# EAGLE design On Axis Encoder (EAGLE 9.6.1)

## Sheet 1 of 8: ATSAMD21G18
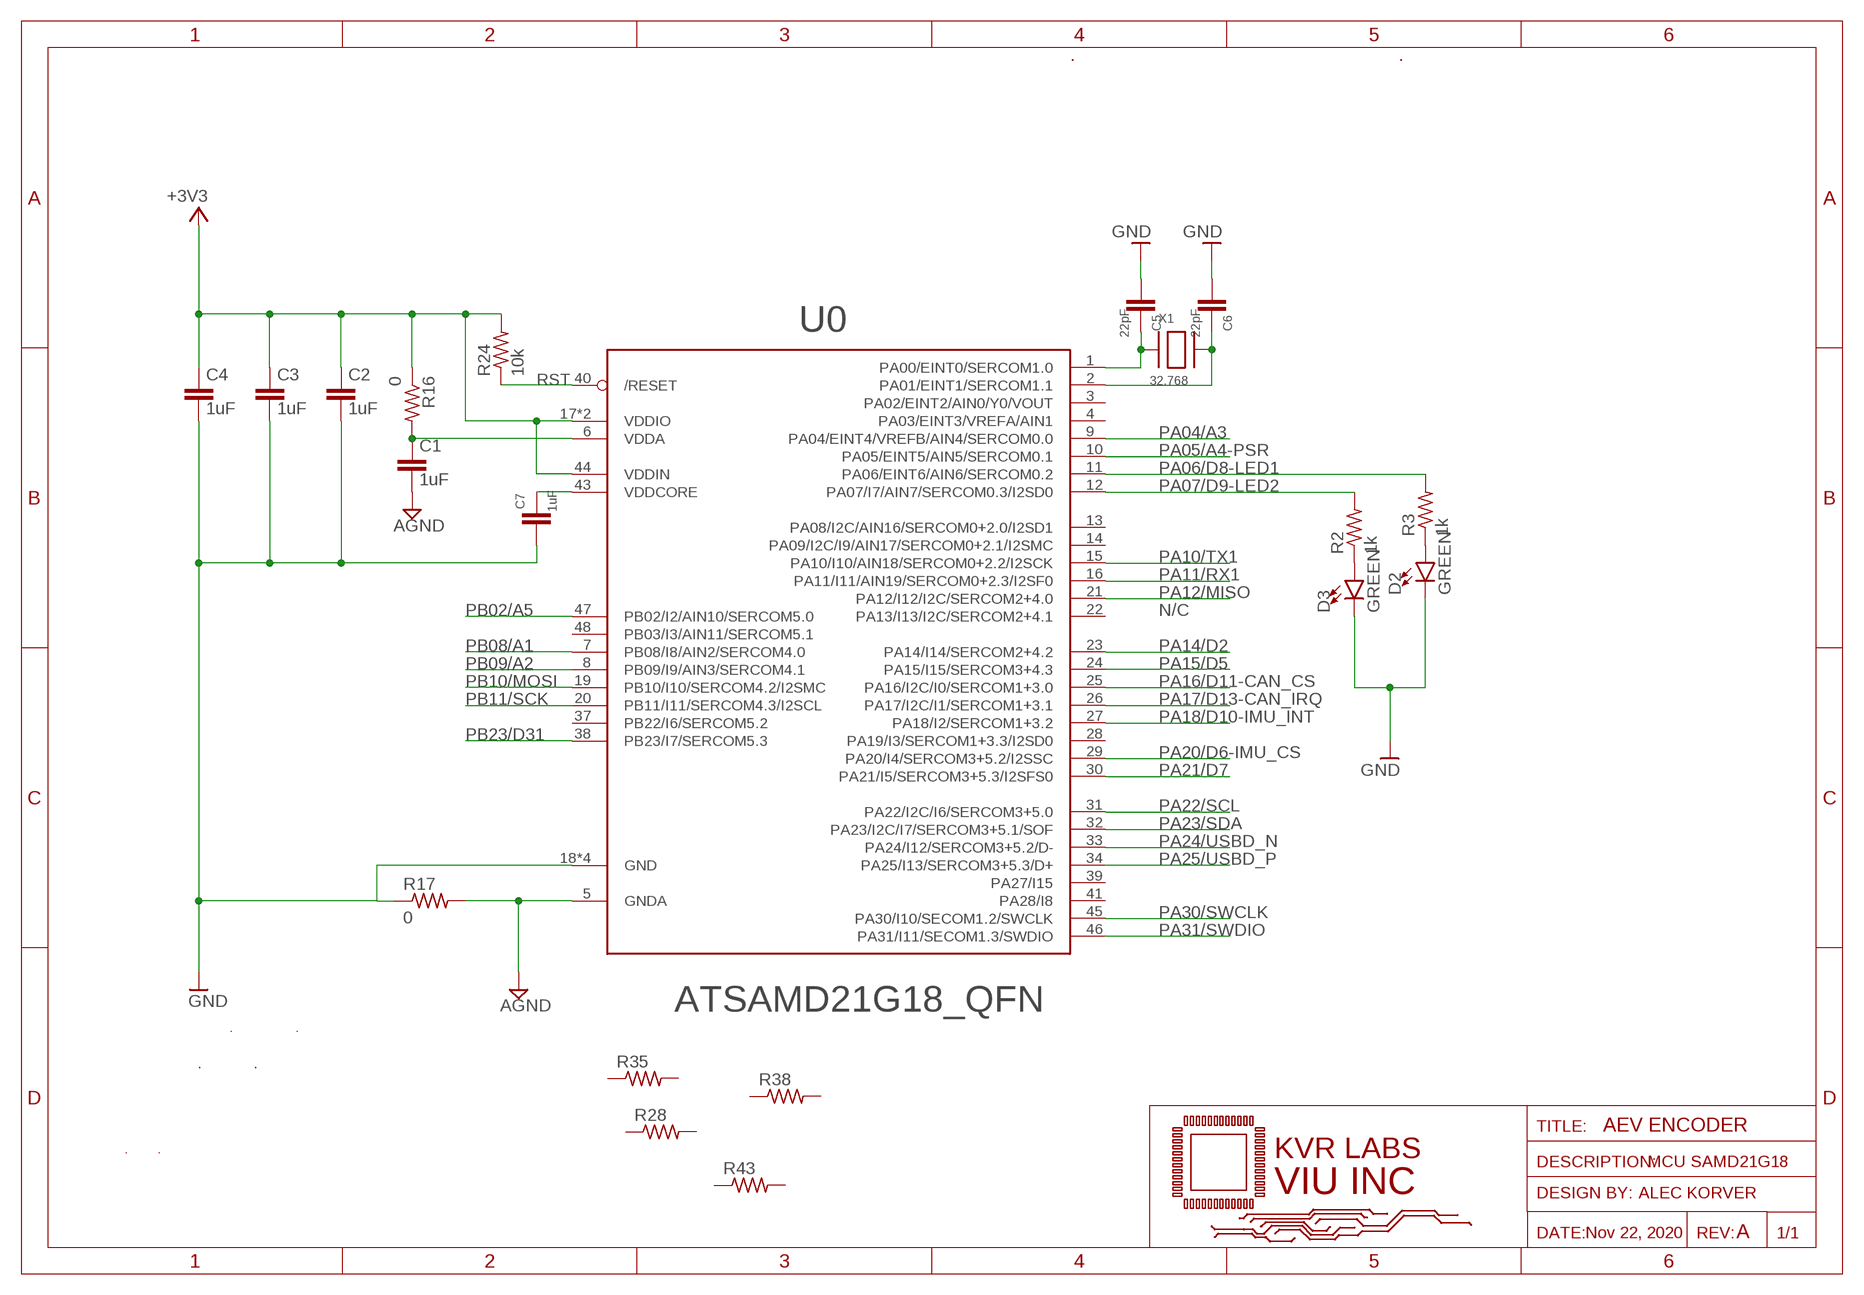
[diagram p0: schematic, sheet 1]

### Parts
C1  1uF  C-EUC0805  [C0805]
C2  1uF  C-EUC0805  [C0805]
C3  1uF  C-EUC0805  [C0805]
C4  1uF  C-EUC0805  [C0805]
C5  22pF  C-EUC0805  [C0805]
C6  22pF  C-EUC0805  [C0805]
C7  1uF  C-EUC0805  [C0805]
D2  GREEN  LED-RED0603  [LED-0603]
D3  GREEN  LED-RED0603  [LED-0603]
R2  1k  R-US_R0603  [R0603]
R3  1k  R-US_R0603  [R0603]
R16  0  R-US_R0805  [R0805]
R17  0  R-US_R0805  [R0805]
R24  10k  R-US_R0805  [R0805]
R28  R-US_R0603  [R0603]
R35  R-US_R0402  [R0402]
R38  R-US_R0201  [R0201]
R43  R-US_R0805  [R0805]
U0  ATSAMD21G18_QFN  ATSAMD21J_QFN  [MICROBUILDER_TQFN48_7MM]
X1  32.768  XTAL-3.2X1.5  [XTAL3215]

### Nets
+3V3: C2.1 C3.1 C4.1 R16.1 R24.2 U0.17(VDDIO) U0.36(VDDIO) U0.44(VDDIN) ; also sheet 3,4,5,6,7,8
AGND: C1.2 R17.2 U0.5(GNDA) ; also sheet 4,8
GND: C2.2 C3.2 C4.2 C5.2 C6.2 C7.2 D2.C D3.C R17.1 U0.18(GND) U0.35(GND) U0.42(GND) U0.THERMAL(GND) ; also sheet 3,4,5,6,7
N$3: D2.A R3.1
N$4: D3.A R2.1
N$9: C5.1 U0.1(PA00/EINT0/SERCOM1.0) X1.P$1
N$10: C6.1 U0.2(PA01/EINT1/SERCOM1.1) X1.P$2
N$23: C1.1 R16.2 U0.6(VDDA)
PA04/A3: U0.9(PA04/EINT4/VREFB/AIN4/SERCOM0.0)
PA05/A4-PSR: U0.10(PA05/EINT5/AIN5/SERCOM0.1) ; also sheet 4
PA06/D8-LED1: R3.2 U0.11(PA06/EINT6/AIN6/SERCOM0.2)
PA07/D9-LED2: R2.2 U0.12(PA07/I7/AIN7/SERCOM0.3/I2SD0)
PA10/TX1: U0.15(PA10/I10/AIN18/SERCOM0+2.2/I2SCK)
PA11/RX1: U0.16(PA11/I11/AIN19/SERCOM0+2.3/I2SF0)
PA12/MISO: U0.21(PA12/I12/I2C/SERCOM2+4.0) ; also sheet 5,7
PA14/D2: U0.23(PA14/I14/SERCOM2+4.2)
PA15/D5: U0.24(PA15/I15/SERCOM3+4.3)
PA16/D11-CAN_CS: U0.25(PA16/I2C/I0/SERCOM1+3.0) ; also sheet 5
PA17/D13-CAN_IRQ: U0.26(PA17/I2C/I1/SERCOM1+3.1) ; also sheet 5
PA18/D10-IMU_INT: U0.27(PA18/I2/SERCOM1+3.2) ; also sheet 7
PA20/D6-IMU_CS: U0.29(PA20/I4/SERCOM3+5.2/I2SSC) ; also sheet 7
PA21/D7: U0.30(PA21/I5/SERCOM3+5.3/I2SFS0)
PA22/SCL: U0.31(PA22/I2C/I6/SERCOM3+5.0) ; also sheet 6
PA23/SDA: U0.32(PA23/I2C/I7/SERCOM3+5.1/SOF) ; also sheet 6
PA24/USBD_N [diff pair]: U0.33(PA24/I12/SERCOM3+5.2/D-) ; also sheet 4
PA25/USBD_P [diff pair]: U0.34(PA25/I13/SERCOM3+5.3/D+) ; also sheet 4
PA30/SWCLK: U0.45(PA30/I10/SECOM1.2/SWCLK) ; also sheet 4
PA31/SWDIO: U0.46(PA31/I11/SECOM1.3/SWDIO) ; also sheet 4
PB02/A5: U0.47(PB02/I2/AIN10/SERCOM5.0)
PB08/A1: U0.7(PB08/I8/AIN2/SERCOM4.0)
PB09/A2: U0.8(PB09/I9/AIN3/SERCOM4.1)
PB10/MOSI: U0.19(PB10/I10/SERCOM4.2/I2SMC) ; also sheet 5,7
PB11/SCK: U0.20(PB11/I11/SERCOM4.3/I2SCL) ; also sheet 5,7
PB23/D31: U0.38(PB23/I7/SERCOM5.3)
RST: R24.1 U0.40(/RESET) ; also sheet 4
VDDCORE2: C7.1 U0.43(VDDCORE)
Unconnected: R28.1 R28.2 R35.1 R35.2 R38.1 R38.2 R43.1 R43.2 U0.3(PA02/EINT2/AIN0/Y0/VOUT) U0.4(PA03/EINT3/VREFA/AIN1) U0.13(PA08/I2C/AIN16/SERCOM0+2.0/I2SD1) U0.14(PA09/I2C/I9/AIN17/SERCOM0+2.1/I2SMC) U0.22(PA13/I13/I2C/SERCOM2+4.1) U0.28(PA19/I3/SERCOM1+3.3/I2SD0) U0.37(PB22/I6/SERCOM5.2) U0.39(PA27/I15) U0.41(PA28/I8) U0.48(PB03/I3/AIN11/SERCOM5.1)

### Notes on the sheet
- N/C
- AEV ENCODER
- MCU SAMD21G18
- Nov 22, 2020 | A

## Sheet 2 of 8: ABSOLUTE ENCODER
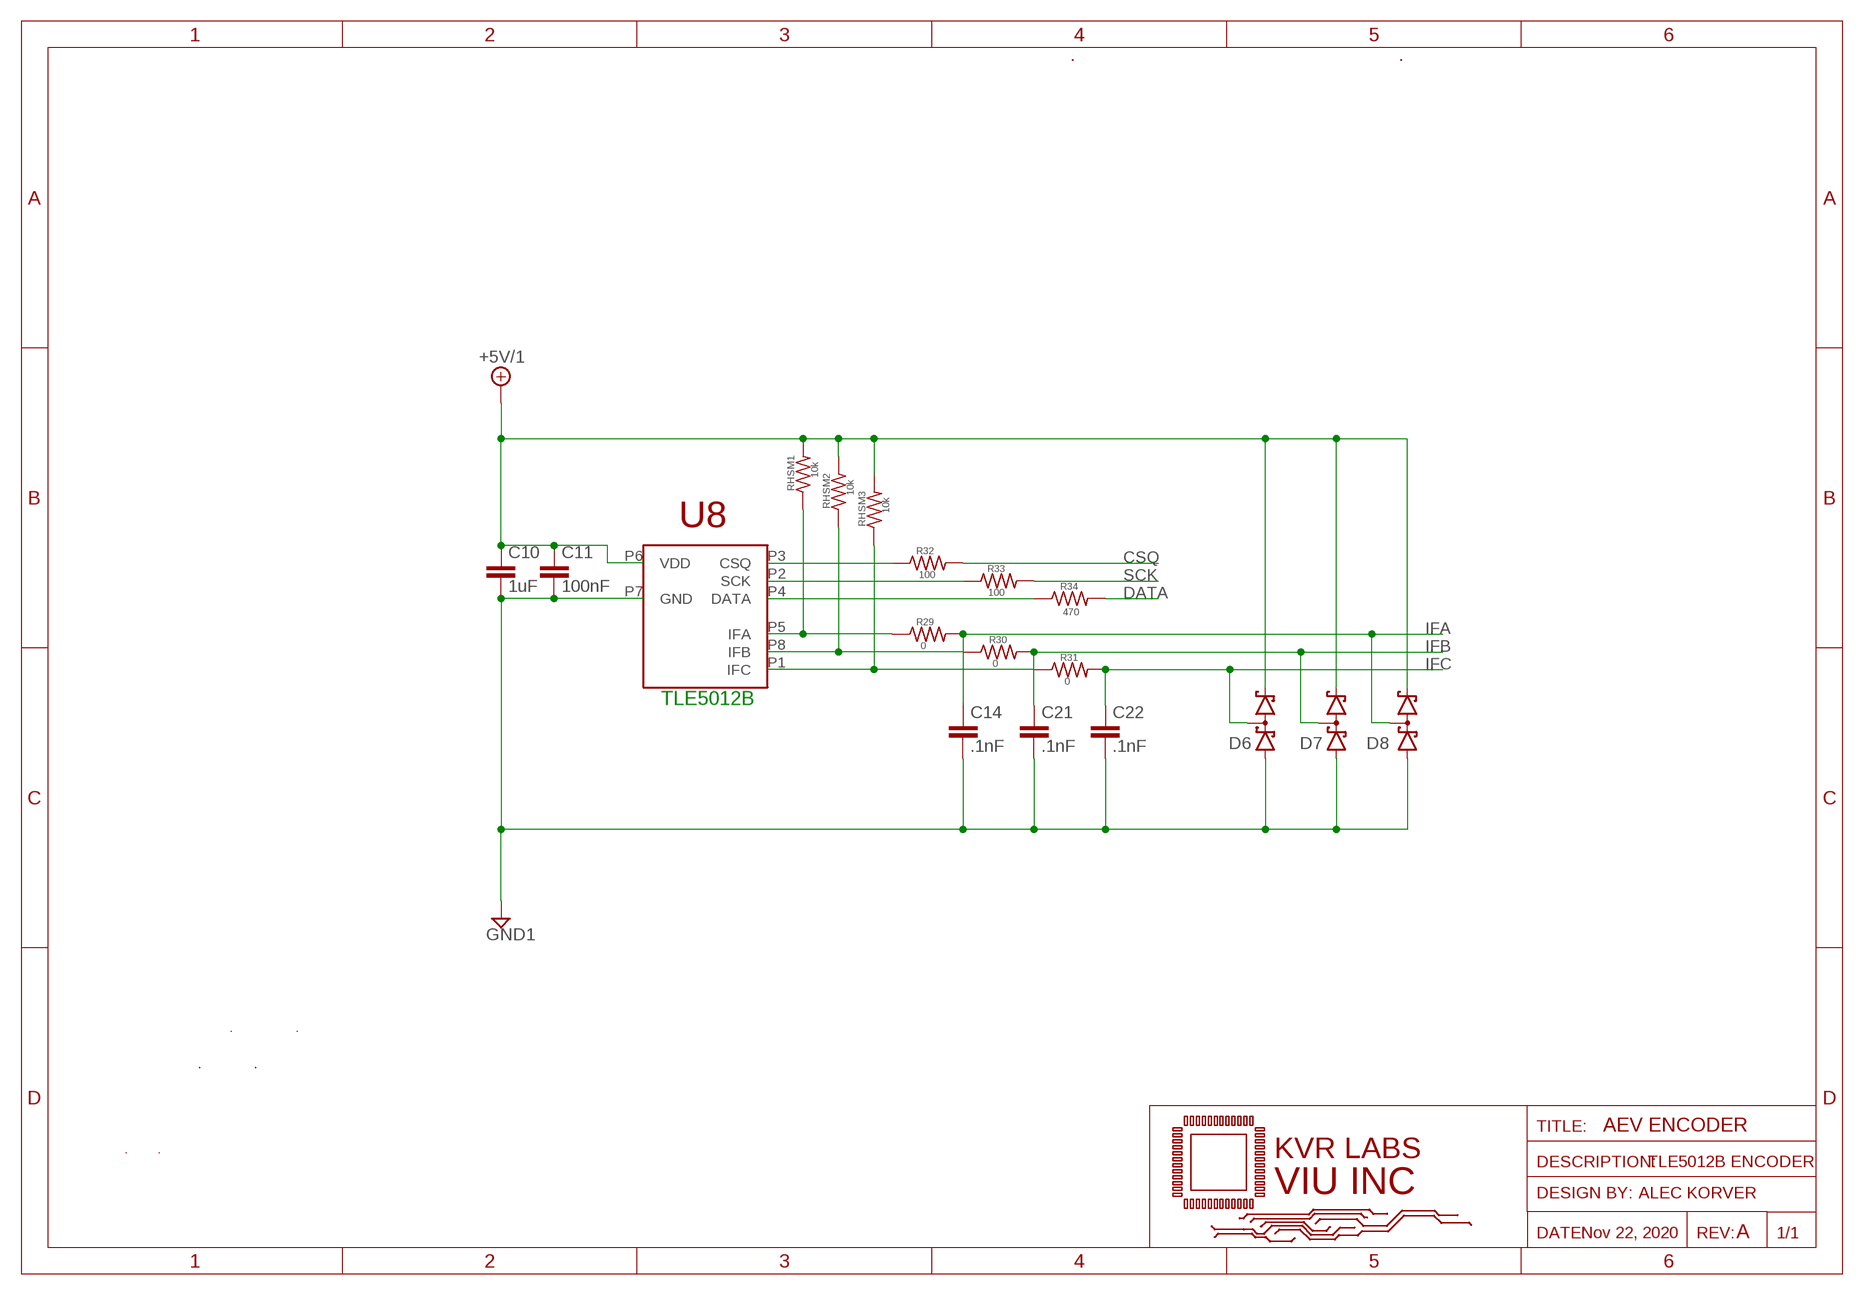
[diagram p1: schematic, sheet 2]

### Parts
C10  1uF  C-EUC0805  [C0805]
C11  100nF  C-EUC0805  [C0805]
C14  .1nF  C-EUC0805  [C0805]
C21  .1nF  C-EUC0805  [C0805]
C22  .1nF  C-EUC0805  [C0805]
D6  BAS70-04  [SOT23]
D7  BAS70-04  [SOT23]
D8  BAS70-04  [SOT23]
R29  0  R-US_R0805  [R0805]
R30  0  R-US_R0805  [R0805]
R31  0  R-US_R0805  [R0805]
R32  100  R-US_R0805  [R0805]
R33  100  R-US_R0805  [R0805]
R34  470  R-US_R0805  [R0805]
RHSM1  10k  R-US_R0805  [R0805]
RHSM2  10k  R-US_R0805  [R0805]
RHSM3  10k  R-US_R0805  [R0805]
U8  TLE5012B  [PG-DSO-8]

### Nets
+5V/1: C10.1 C11.1 D6.2(C2) D7.2(C2) D8.2(C2) RHSM1.2 RHSM2.2 RHSM3.2 U8.P6(VDD) ; also sheet 4
CSQ: R32.2 ; also sheet 4
DATA: R34.2 ; also sheet 4
GND1: C10.2 C11.2 C14.2 C21.2 C22.2 D6.1(A1) D7.1(A1) D8.1(A1) U8.P7(GND) ; also sheet 4
IFA: C14.1 D8.3(C1A2) R29.2 ; also sheet 4
IFB: C21.1 D7.3(C1A2) R30.2 ; also sheet 4
IFC: C22.1 D6.3(C1A2) R31.2 ; also sheet 4
N$35: R32.1 U8.P3(CSQ)
N$36: R33.1 U8.P2(SCK)
N$37: R34.1 U8.P4(DATA)
N$38: R29.1 RHSM1.1 U8.P5(IFA)
N$39: R30.1 RHSM2.1 U8.P8(IFB)
N$40: R31.1 RHSM3.1 U8.P1(IFC)
SCK: R33.2 ; also sheet 4

### Notes on the sheet
- U8
- TLE5012B
- AEV ENCODER
- TLE5012B ENCODER
- Nov 22, 2020 | A

## Sheet 3 of 8: Low Dropout Regulator 3v3
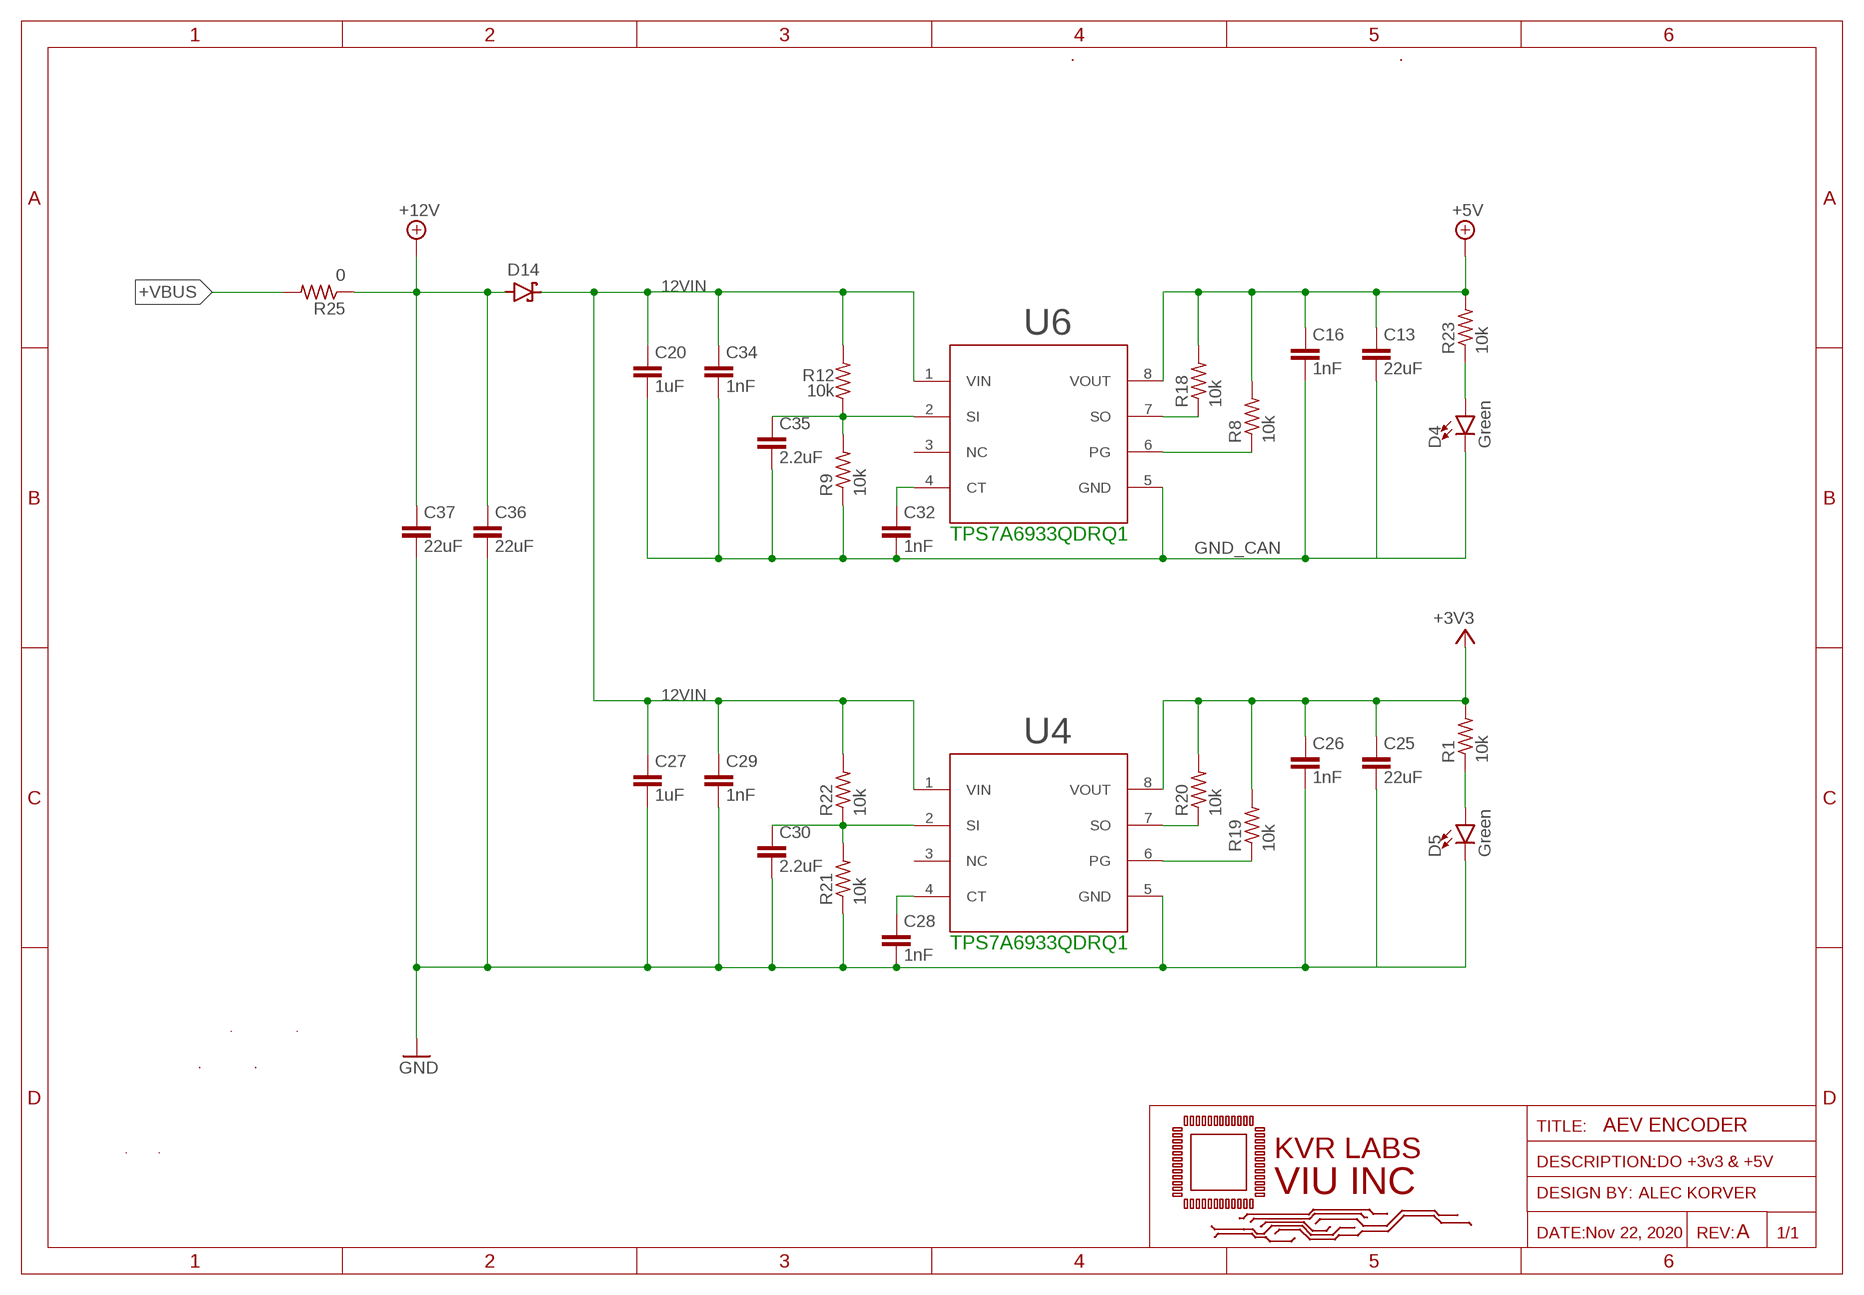
[diagram p2: schematic, sheet 3]

### Parts
C13  22uF  C-EUC0805  [C0805]
C16  1nF  C-EUC0805  [C0805]
C20  1uF  C-EUC0805  [C0805]
C25  22uF  C-EUC0805  [C0805]
C26  1nF  C-EUC0805  [C0805]
C27  1uF  C-EUC0805  [C0805]
C28  1nF  C-EUC0805  [C0805]
C29  1nF  C-EUC0805  [C0805]
C30  2.2uF  C-EUC0805  [C0805]
C32  1nF  C-EUC0805  [C0805]
C34  1nF  C-EUC0805  [C0805]
C35  2.2uF  C-EUC0805  [C0805]
C36  22uF  C-EUC1206  [C1206]
C37  22uF  C-EUC1206  [C1206]
D4  Green  LED-GREEN1206-BOTTOM  [LED-1206-BOTTOM]
D5  Green  LED-GREEN1206-BOTTOM  [LED-1206-BOTTOM]
D14  MBR0520LT1G  SCHOTTKY_MBR0520LT1GDO-219  [SODFL3718X115]
R1  10k  R-US_R0805  [R0805]
R8  10k  R-US_R0805  [R0805]
R9  10k  R-US_R0805  [R0805]
R12  10k  R-US_R0805  [R0805]
R18  10k  R-US_R0805  [R0805]
R19  10k  R-US_R0805  [R0805]
R20  10k  R-US_R0805  [R0805]
R21  10k  R-US_R0805  [R0805]
R22  10k  R-US_R0805  [R0805]
R23  10k  R-US_R0805  [R0805]
R25  0  R-US_R0805  [R0805]
U4  Value  TPS7A6933QDRQ1  [D0008A_N]
U6  Value  TPS7A6933QDRQ1  [D0008A_N]

### Nets
12VIN: C20.1 C27.1 C29.1 C34.1 D14.1(C) R12.2 R22.2 U4.1(VIN) U6.1(VIN)
+3V3: C25.1 C26.1 R1.2 R19.2 R20.2 U4.8(VOUT) ; also sheet 1,4,5,6,7,8
+5V: C13.1 C16.1 R8.2 R18.2 R23.2 U6.8(VOUT) ; also sheet 5
+12V: C36.1 C37.1 D14.2(A) R25.1 ; also sheet 4
+VBUS: R25.2 ; also sheet 4
GND: C25.2 C26.2 C27.2 C28.2 C29.2 C30.2 C36.2 C37.2 D5.C R21.1 U4.5(GND) ; also sheet 1,4,5,6,7
GND_CAN: C13.2 C16.2 C20.2 C32.2 C34.2 C35.2 D4.C R9.1 U6.5(GND) ; also sheet 5
N$2: D5.A R1.1
N$5: C35.1 R9.2 R12.1 U6.2(SI)
N$12: C30.1 R21.2 R22.1 U4.2(SI)
N$16: R19.1 U4.6(PG)
N$17: R20.1 U4.7(SO)
N$18: C28.1 U4.4(CT)
N$19: R8.1 U6.6(PG)
N$20: R18.1 U6.7(SO)
N$21: C32.1 U6.4(CT)
N$22: D4.A R23.1
Unconnected: U4.3(NC) U6.3(NC)

### Notes on the sheet
- TPS7A6933QDRQ1
- TPS7A6933QDRQ1
- AEV ENCODER
- LDO +3v3 & +5V
- Nov 22, 2020 | A

## Sheet 4 of 8: Connectors
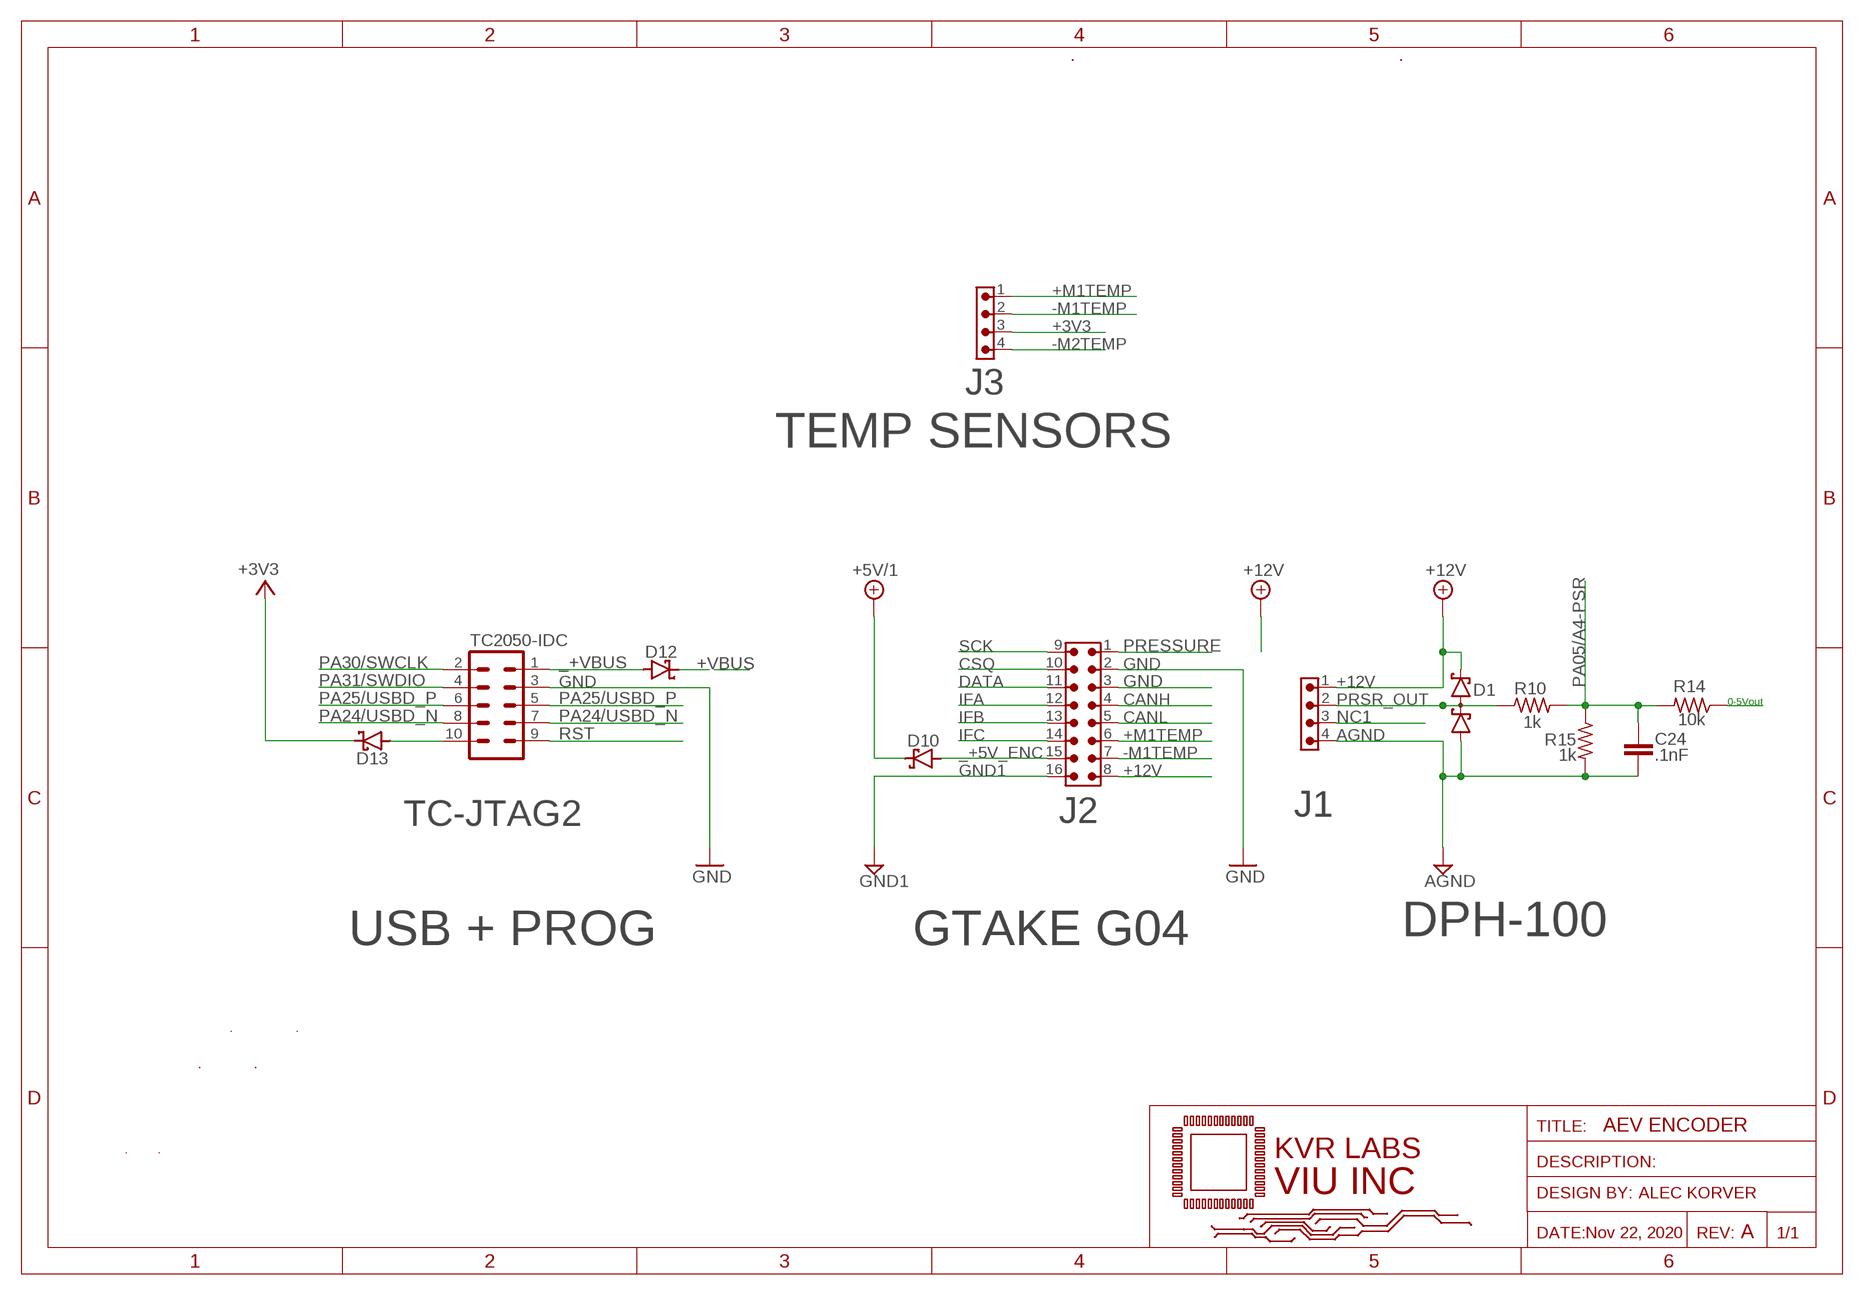
[diagram p3: schematic, sheet 4]

### Parts
C24  .1nF  C-EUC0805  [C0805]
D1  BAS70-04  [SOT23]
D10  MBR0520LT1G  SCHOTTKY_MBR0520LT1GDO-219  [SODFL3718X115]
D12  MBR0520LT1G  SCHOTTKY_MBR0520LT1GDO-219  [SODFL3718X115]
D13  MBR0520LT1G  SCHOTTKY_MBR0520LT1GDO-219  [SODFL3718X115]
J1  6620XX11122_66200411122  [66200411122]
J2  6620XX21122_66201621122  [66201621122]
J3  6620XX11122_66200411122  [66200411122]
R10  1k  R-US_R0805  [R0805]
R14  10k  R-US_R0805  [R0805]
R15  1k  R-US_R0805  [R0805]
TC-JTAG2  TC2050-IDC  [TC2050-IDC]

### Nets
+3V3: D13.1(C) J3.3 ; also sheet 1,3,5,6,7,8
+5V/1: D10.1(C) ; also sheet 2
+12V: D1.2(C2) J1.1 J2.8 ; also sheet 3
+M1TEMP: J2.6 J3.1
+VBUS: D12.1(C) ; also sheet 3
-M1TEMP: J2.7 J3.2
-M2TEMP: J3.4 ; also sheet 8
_+5V_ENC: D10.2(A) J2.15
_+VBUS: D12.2(A) TC-JTAG2.1
AGND: C24.2 D1.1(A1) J1.4 R15.2 ; also sheet 1,8
CANH: J2.4 ; also sheet 5
CANL: J2.5 ; also sheet 5
CSQ: J2.10 ; also sheet 2
DATA: J2.11 ; also sheet 2
GND: J2.2 J2.3 TC-JTAG2.3 ; also sheet 1,3,5,6,7
GND1: J2.16 ; also sheet 2
IFA: J2.12 ; also sheet 2
IFB: J2.13 ; also sheet 2
IFC: J2.14 ; also sheet 2
N$13: D13.2(A) TC-JTAG2.10
NC1: J1.3
PA05/A4-PSR: C24.1 R10.2 R14.2 R15.1 ; also sheet 1
PA24/USBD_N [diff pair]: TC-JTAG2.7 TC-JTAG2.8 ; also sheet 1
PA25/USBD_P [diff pair]: TC-JTAG2.5 TC-JTAG2.6 ; also sheet 1
PA30/SWCLK: TC-JTAG2.2 ; also sheet 1
PA31/SWDIO: TC-JTAG2.4 ; also sheet 1
PRESSURE: J2.1 R14.1
PRSR_OUT: D1.3(C1A2) J1.2 R10.1
RST: TC-JTAG2.9 ; also sheet 1
SCK: J2.9 ; also sheet 2

### Notes on the sheet
- TEMP SENSORS
- 0-5Vout
- USB + PROG | GTAKE G04 | DPH-100
- AEV ENCODER
- Nov 22, 2020 | A

## Sheet 5 of 8: CANbus
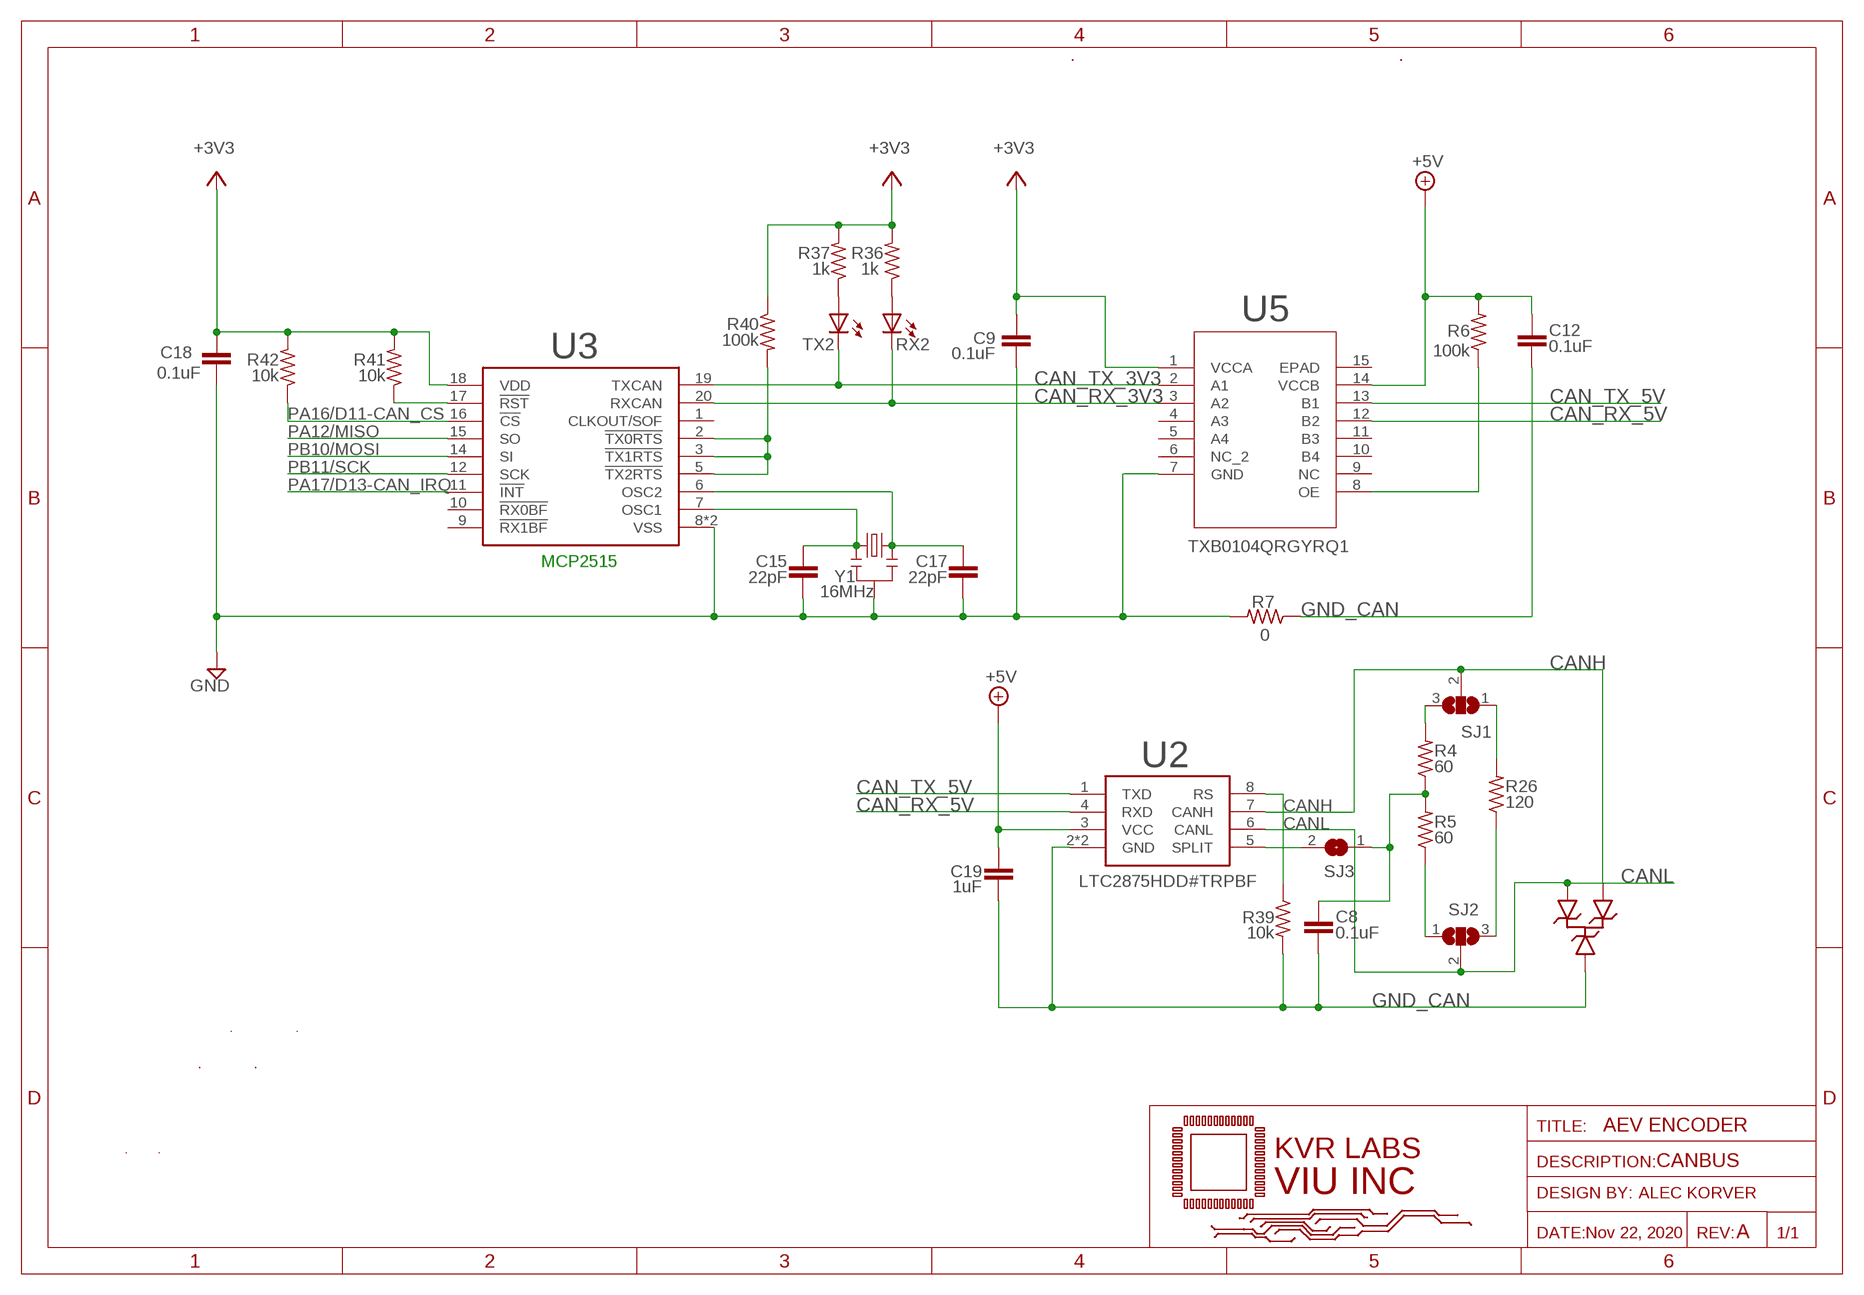
[diagram p4: schematic, sheet 5]

### Parts
C8  0.1uF  C-EUC0805  [C0805]
C9  0.1uF  C-EUC0805  [C0805]
C12  0.1uF  C-EUC0805  [C0805]
C15  22pF  C-EUC0805  [C0805]
C17  22pF  C-EUC0805  [C0805]
C18  0.1uF  C-EUC0805  [C0805]
C19  1uF  C-EUC0805  [C0805]
R4  60  R-US_R0805  [R0805]
R5  60  R-US_R0805  [R0805]
R6  100k  R-US_R0805  [R0805]
R7  0  R-US_R0805  [R0805]
R26  120  R-US_R0805  [R0805]
R36  1k  R-US_R0805  [R0805]
R37  1k  R-US_R0805  [R0805]
R39  10k  R-US_R0805  [R0805]
R40  100k  R-US_R0805  [R0805]
R41  10k  R-US_R0805  [R0805]
R42  10k  R-US_R0805  [R0805]
RX2  LEDCHIPLED_0805  [CHIPLED_0805]
SJ1  SJ2W  [SJ_2]
SJ2  SJ2W  [SJ_2]
SJ3  SJ  [SJ]
TX2  LEDCHIPLED_0805  [CHIPLED_0805]
U2  LTC2875HDD#TRPBF  LTC2875-8-DFN  [SON50P300X300X80-9T165X238N]
U3  MCP2515-E/ML  MCP2515QFN-20  [QFN50P400X400X100-21T270N]
U5  TXB0104QRGYRQ1  [RGY14_2P05X2P05]
U$2  μCLAMP2492SQ  [SOT-23_3L_ONS]
Y1  16MHz  RESONATORSMD  [RESONATOR-SMD]

### Nets
+3V3: C9.1 C18.1 R36.2 R37.2 R40.1 R41.2 R42.2 U3.18(VDD) U5.1(VCCA) ; also sheet 1,3,4,6,7,8
+5V: C12.1 C19.1 R6.2 U2.3(VCC) U5.14(VCCB) ; also sheet 3
CAN_RX_3V3: RX2.C U3.20(RXCAN) U5.3(A2)
CAN_RX_5V: U2.4(RXD) U5.12(B2)
CAN_TX_3V3: TX2.C U3.19(TXCAN) U5.2(A1)
CAN_TX_5V: U2.1(TXD) U5.13(B1)
CANH: SJ1.2 U2.7(CANH) U$2.2 ; also sheet 4
CANL: SJ2.2 U2.6(CANL) U$2.1 ; also sheet 4
GND: C9.2 C15.2 C17.2 C18.2 R7.2 U3.8(VSS) U3.21(VSS) U5.7(GND) Y1.2 ; also sheet 1,3,4,6,7
GND_CAN: C8.2 C12.2 C19.2 R7.1 R39.2 U2.2(GND) U2.9(GND) U$2.3 ; also sheet 3
N$6: R6.1 U5.8(OE)
N$7: R39.1 U2.8(RS)
N$8: SJ3.2 U2.5(SPLIT)
N$26: R36.1 RX2.A
N$27: R37.1 TX2.A
N$30: R41.1 U3.17(!RST)
N$31: R40.2 U3.2(!TX0RTS) U3.3(!TX1RTS) U3.5(!TX2RTS)
N$32: C17.1 U3.6(OSC2) Y1.3
N$33: C15.1 U3.7(OSC1) Y1.1
PA12/MISO: U3.15(SO) ; also sheet 1,7
PA16/D11-CAN_CS: R42.1 U3.16(!CS) ; also sheet 1
PA17/D13-CAN_IRQ: U3.11(!INT) ; also sheet 1
PB10/MOSI: U3.14(SI) ; also sheet 1,7
PB11/SCK: U3.12(SCK) ; also sheet 1,7
RSH: R4.2 SJ1.3
RSL: R5.1 SJ2.1
RTH: R26.2 SJ1.1
RTL: R26.1 SJ2.3
SPLIT: C8.1 R4.1 R5.2 SJ3.1
Unconnected: U3.1(CLKOUT/SOF) U3.9(!RX1BF) U3.10(!RX0BF) U5.4(A3) U5.5(A4) U5.6(NC_2) U5.9(NC) U5.10(B4) U5.11(B3) U5.15(EPAD)

### Notes on the sheet
- MCP2515
- AEV ENCODER
- CANBUS
- Nov 22, 2020 | A

## Sheet 6 of 8: PRESSURE SENSOR
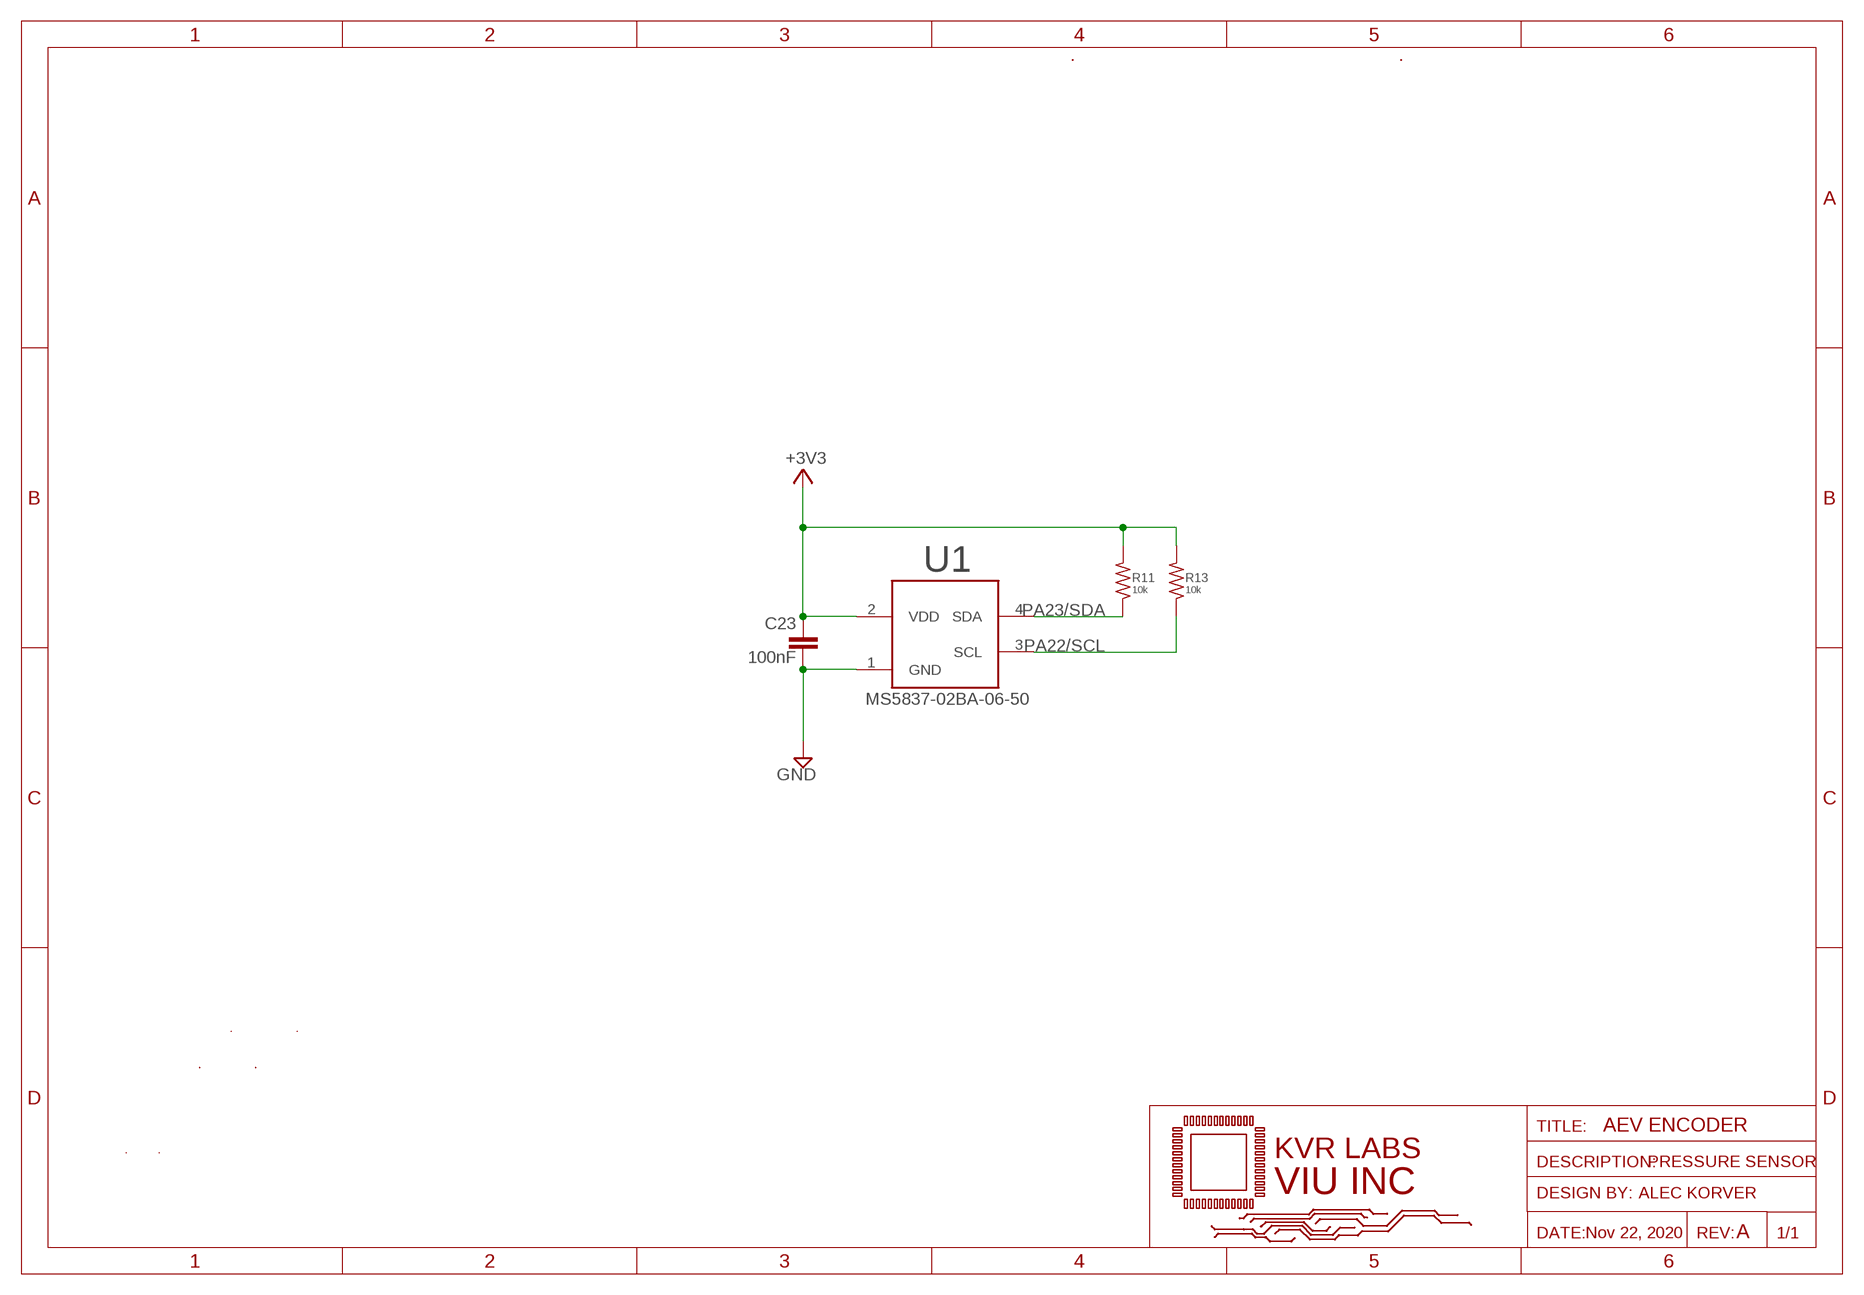
[diagram p5: schematic, sheet 6]

### Parts
C23  100nF  C-EUC0603  [C0603]
R11  10k  R-US_R0603  [R0603]
R13  10k  R-US_R0603  [R0603]
U1  MS5837-02BA-06-50  [DFN330X330X275-4N]

### Nets
+3V3: C23.1 R11.2 R13.2 U1.2(VDD) ; also sheet 1,3,4,5,7,8
GND: C23.2 U1.1(GND) ; also sheet 1,3,4,5,7
PA22/SCL: R13.1 U1.3(SCL) ; also sheet 1
PA23/SDA: R11.1 U1.4(SDA) ; also sheet 1

### Notes on the sheet
- AEV ENCODER
- PRESSURE SENSOR
- Nov 22, 2020 | A

## Sheet 7 of 8: IMU - ICM20648
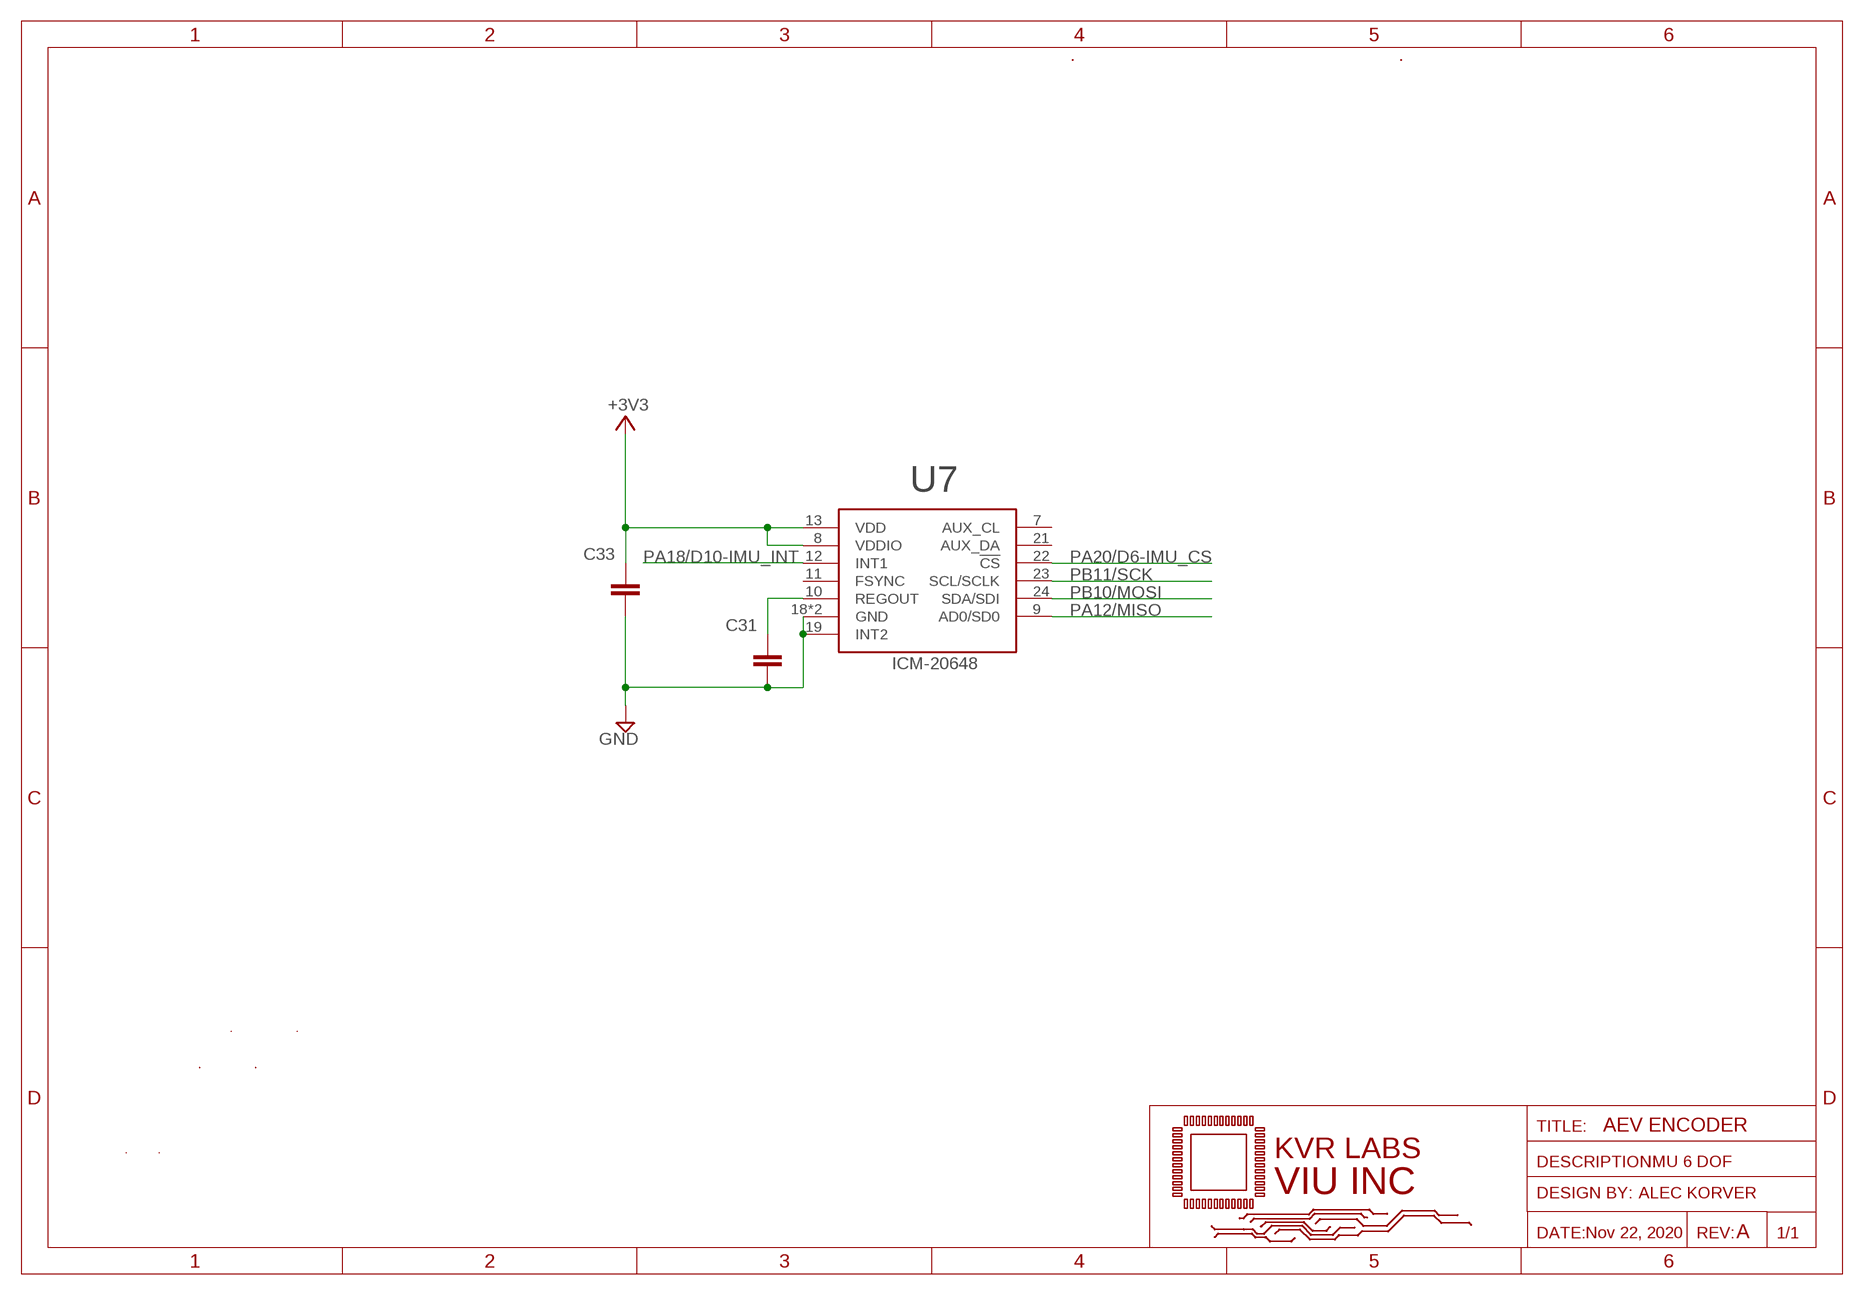
[diagram p6: schematic, sheet 7]

### Parts
C31  0.1uF  C0603  [0603]
C33  0.1uF  C0603  [0603]
U7  ICM-20648  [ICM-20648]

### Nets
+3V3: C33.P$1 U7.8(VDDIO) U7.13(VDD) ; also sheet 1,3,4,5,6,8
GND: C31.P$2 C33.P$2 U7.18(GND) U7.19(INT2) U7.20(GND) ; also sheet 1,3,4,5,6
PA12/MISO: U7.9(AD0/SD0) ; also sheet 1,5
PA18/D10-IMU_INT: U7.12(INT1) ; also sheet 1
PA20/D6-IMU_CS: U7.22(!CS) ; also sheet 1
PB10/MOSI: U7.24(SDA/SDI) ; also sheet 1,5
PB11/SCK: U7.23(SCL/SCLK) ; also sheet 1,5
REGOUT2: C31.P$1 U7.10(REGOUT)
Unconnected: U7.7(AUX_CL) U7.11(FSYNC) U7.21(AUX_DA)

### Notes on the sheet
- AEV ENCODER
- IMU 6 DOF
- Nov 22, 2020 | A

## Sheet 8 of 8: TEMP SENSORS
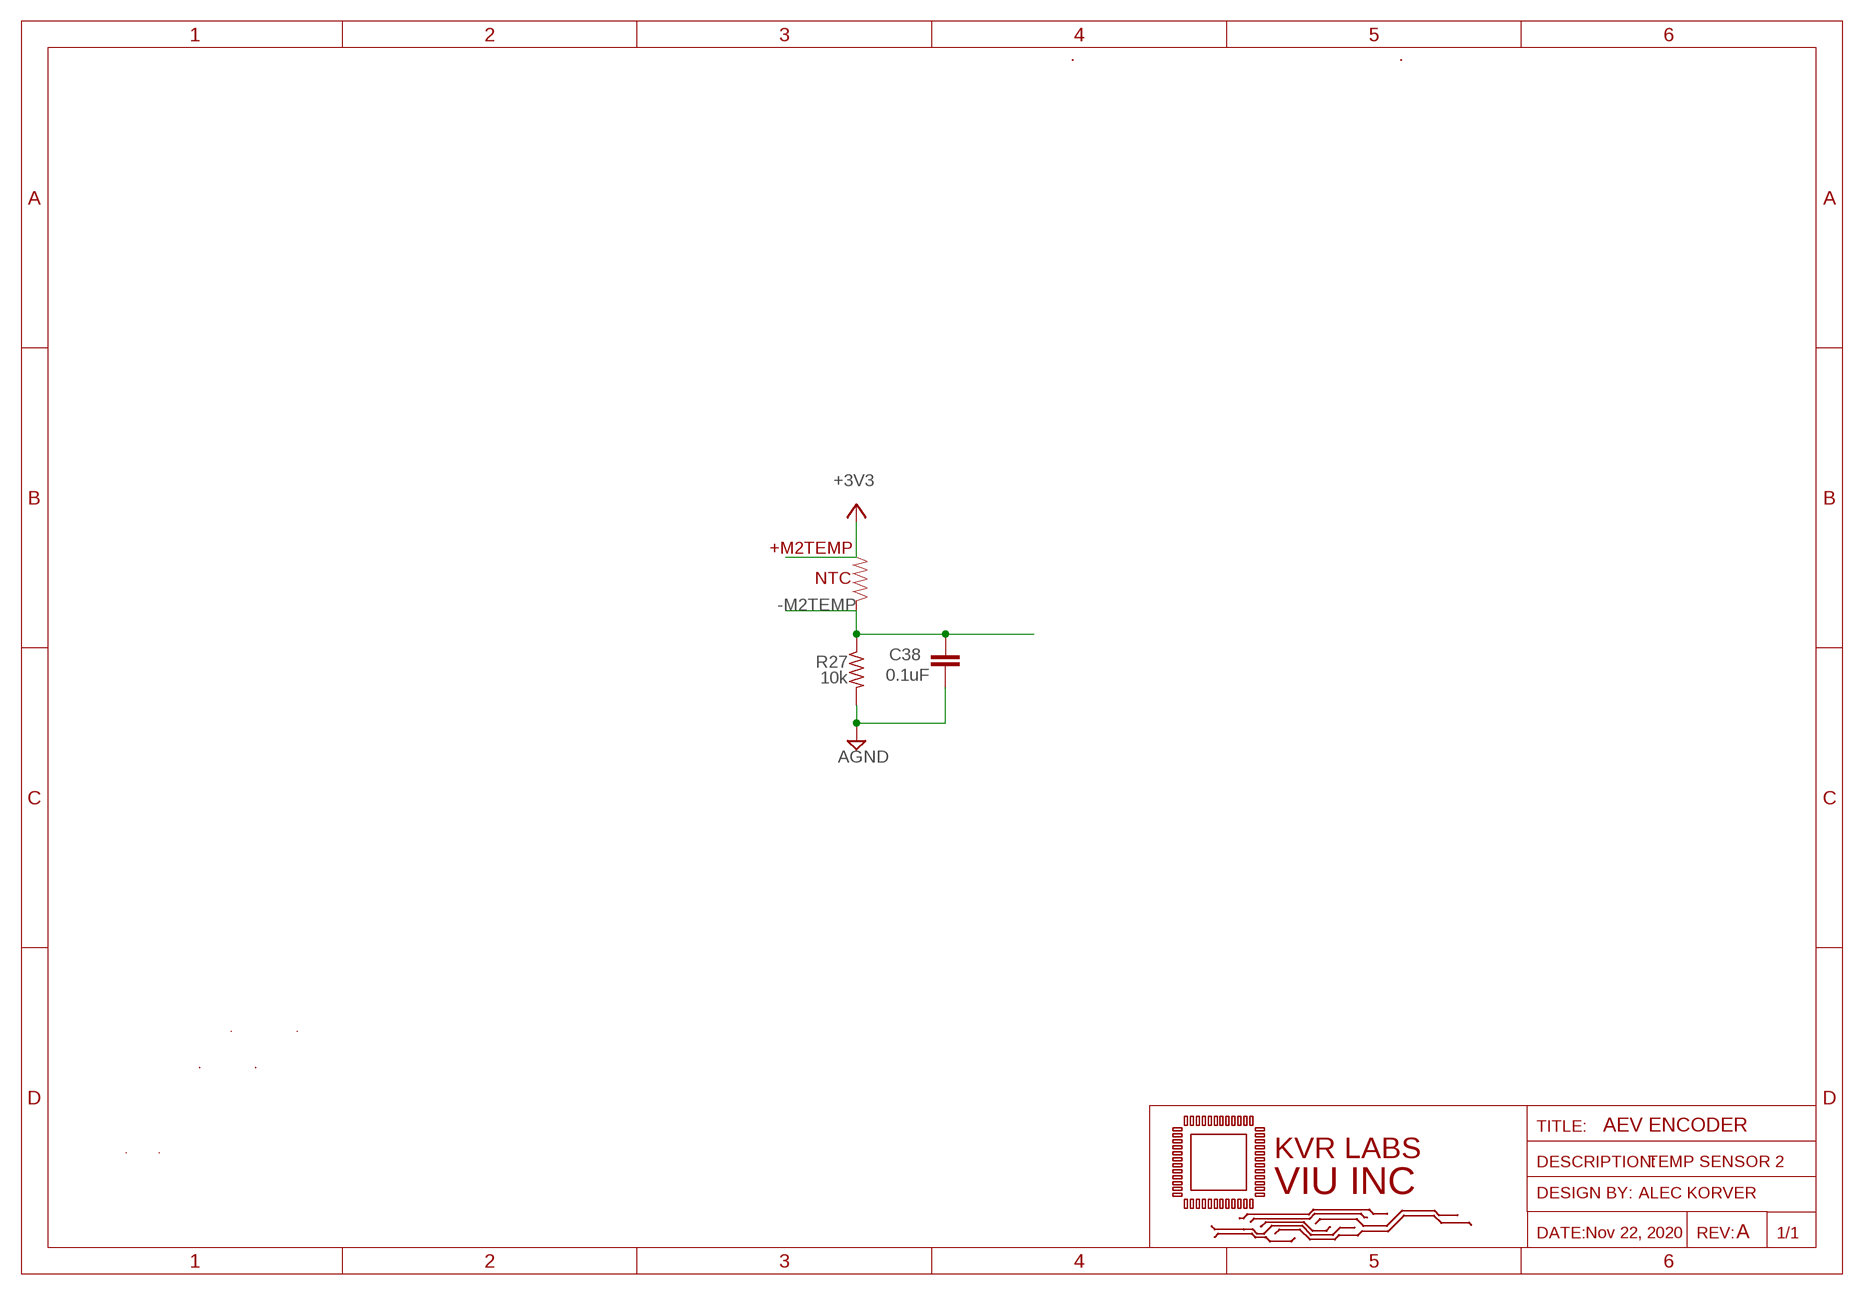
[diagram p7: schematic, sheet 8]

### Parts
C38  0.1uF  C-EUC0805  [C0805]
R27  10k  R-US_R0805  [R0805]

### Nets
-M2TEMP: C38.1 R27.1 ; also sheet 4
AGND: C38.2 R27.2 ; also sheet 1,4

### Notes on the sheet
- +M2TEMP
- NTC
- AEV ENCODER
- TEMP SENSOR 2
- Nov 22, 2020 | A

## Library data of the parts
C1-C30 C32 C34-C38 = rcl:C-EU: CAPACITOR, European symbol; SPICEPREFIX: C
C31 C33 = Custom_library:C0603
D1 D6-D8 = diode:BAS70-04: Silicon Schottky Diodes General-purpose diode for high-speed switching
D2 D3 = SparkFun-LED:LED-RED: Red SMD LED Used in manufacturing of most products at SparkFun Packages: 0603 - SMD 0603 package [Product Link] <http://docs.avagotech.com/docs/AV02-0551EN> 0603 SMART - SMD 0603 SMART package ( more efficient and expensive)[Product Link] <http://www.osram-os.com/Graphics/XPic2/00077099_0.pdf> 1206 - SMD1206 package [Product Link] <https://www.sparkfun.com/datasheets/DevTools/LilyPad/Q150OVS4.pdff> SparkFun Products: Pro Mini 328 -5V <https://www.sparkfun.com/products/821> RedBoard <https://www.sparkfun.com/products/12757> IOIO-OTG <https://www.sparkfun.com/products/13613>; PROD_ID: DIO-00819; VALUE: RED
D4 D5 = SparkFun-LED:LED-GREEN: Green SMD LED Used in manufacturing of various products at SparkFun Packages: 0603 - SMD 0603 package [Product Link] <http://www.futureelectronics.com/en/technologies/semiconductors/optoelectronics/leds/Pages/9894312-LTST-C190GKT.aspx?CrossPart=HSMG-C190&IM=0> LilyPad 1206 - SMD1206 LilyPad package [Product Link] <http://www.futureelectronics.com/en/Technologies/Product.aspx?ProductID=IN150NGHARVATEKCORPORATION2049943&IM=0> 1206 - SMD1206 package [Product Link] <http://www.futureelectronics.com/en/technologies/semiconductors/optoelectronics/leds/Pages/8315665-LTST-C150KGKT.aspx?IM=0> 1206 Bottom Mount -SMD 1206 Bottom Mount [Product Link] <http://www.digikey.com/product-detail/en/lite-on-inc/LTST-C230KGKT/160-1456-1-ND/386854> SparkFun Products: Pro Mini 328 -5V <https://www.sparkfun.com/products/821> RedBoard <https://www.sparkfun.com/products/12757> MP3 Trigger <https://www.sparkfun.com/products/13720> Makey Makey <https://www.sparkfun.com/products/11076>; PROD_ID: DIO-11076
D10 D12-D14 = Diode:SCHOTTKY_: Schottky Diode - Popular parts; CATEGORY: Diode; DESCRIPTION: DIODE SCHOTTKY 20V 500MA SOD123; MANUFACTURER: ON Semiconductor; MPN: MBR0520LT1G; SUB-CATEGORY: Schottky
J1 J3 = Wurth_Connectors_WR-MPC3:6620XX11122_66200411122: WR-MPC3 Single Row Male Vertical Header KIND PROPERTIES Pitch 3 mm Gender Male MATERIAL PROPERTIES Insulator Material LCP Insulator Flammability Rating UL94 V-0 Insulator Color Black Contact Material Copper Alloy Contact Plating Tin Contact Type Stamped GENERAL INFORMATION Operating Temperature -40 up to +105 °C Compliance:RoHS Working Voltage 250 V (AC) Withstanding Voltage 1500 V (AC) Contact Resistance 10 mΩ RISO 1000 MΩ CERTIFICATION UL Approval E323964 WIRE PROPERTIES Packaging Tube <https://katalog.we-online.de/media/images/v2/o33166v209%20Family_WR-MPC3_6620xx11122.jpg> Details see: https://katalog.we-online.de/en/em/MPC3_3_00_MALE_SINGLE_ROW_VERTICAL_HEADER_6620XX11122 Created by Yingchun,Shan 2019-11-15 2019 (C) Würth Elektronik; CONTACT-RESISTANCE: 10Ohm; DATASHEET-URL: https://katalog.we-online.com/em/datasheet/66200411122.pdf; GENDER: Male; IR1: 5A; L: 15.65mm; MATE-WITH: WR-MPC3 3.00 mm Female Single Row Receptacle; MOUNT: THT; PACKAGING: Tube; PART-NUMBER: 66200411122; PCB-CABLE-PANEL: PCB; PINS: 4; PITCH: 3mm; ROWS: Single; TOL-R: max.; TYPE: Vertical; WORKING-VOLTAGE: 250V(AC)
J2 = Wurth_Connectors_WR-MPC3:6620XX21122_66201621122: WR-MPC3 3.00 mm Male Dual Row Vertical Header KIND PROPERTIES: Pitch:3 mm Gender:Male MATERIAL PROPERTIES: Insulator Material:LCP Insulator Flammability Rating:UL94 V-0 Insulator Color:Black Contact Material:Copper Alloy Contact Plating:Tin Contact Type:Stamped GENERAL INFORMATION Operating Temperature:-40 up to +105 °C Working Voltage:250V (AC) Withstanding Voltage:1500 V (AC) Contact Resistance:10 mΩ RISO:1000 MΩ CERTIFICATION UL Approval:E323964 PACKAGING PROPERTIES Packaging:Tube <https://katalog.we-online.com/media/images/v2/o33170v209%20Family_WR-MPC3_6620xx21122.jpg> Details see: https://katalog.we-online.com/en/em/MPC3_3_00_MALE_DUAL_ROW_VERTICAL_HEADER_6620XX21122 Updated by Yingchun,Shan 2019-11-13 2019 (C) Würth Elektronik; CONTACT-RESISTANCE: 10Ohm; DATASHEET-URL: https://katalog.we-online.com/em/datasheet/66201621122.pdf; GENDER: Male; IR1: 5A; L: 27.7mm; MATE-WITH: WR-MPC3 3.00 mm Female Dual Row Receptacle; MOUNT: THT; PACKAGING: Tube; PART-NUMBER: 66201621122; PCB-CABLE-PANEL: PCB; PINS: 16; PITCH: 3mm; ROWS: Dual; TOL-R: max.; TYPE: Vertical; WORKING-VOLTAGE: 250V(AC)
R1-R43 RHSM1-RHSM3 = rcl:R-US_: RESISTOR, American symbol; SPICEPREFIX: R
RX2 TX2 = adafruit:LED: LED OSRAM: - CHIPLED LG R971, LG N971, LY N971, LG Q971, LY Q971, LO R971, LY R971 LH N974, LH R974 LS Q976, LO Q976, LY Q976 LO Q996 - Hyper CHIPLED LW Q18S LB Q993, LB Q99A, LB R99A - SideLED LS A670, LO A670, LY A670, LG A670, LP A670 LB A673, LV A673, LT A673, LW A673 LH A674 LY A675 LS A676, LA A676, LO A676, LY A676, LW A676 LS A679, LY A679, LG A679 - Hyper Micro SIDELED® LS Y876, LA Y876, LO Y876, LY Y876 LT Y87S - SmartLED LW L88C, LW L88S LB L89C, LB L89S, LG L890 LS L89K, LO L89K, LY L89K LS L896, LA L896, LO L896, LY L896 - TOPLED LS T670, LO T670, LY T670, LG T670, LP T670 LSG T670, LSP T670, LSY T670, LOP T670, LYG T670 LG T671, LOG T671, LSG T671 LB T673, LV T673, LT T673, LW T673 LH T674 LS T676, LA T676, LO T676, LY T676, LB T676, LH T676, LSB T676, LW T676 LB T67C, LV T67C, LT T67C, LS T67K, LO T67K, LY T67K, LW E67C LS E67B, LA E67B, LO E67B, LY E67B, LB E67C, LV E67C, LT E67C LW T67C LS T679, LY T679, LG T679 LS T770, LO T770, LY T770, LG T770, LP T770 LB T773, LV T773, LT T773, LW T773 LH T774 LS E675, LA E675, LY E675, LS T675 LS T776, LA T776, LO T776, LY T776, LB T776 LHGB T686 LT T68C, LB T68C - Hyper Mini TOPLED® LB M676 - Mini TOPLED Santana® LG M470 LS M47K, LO M47K, LY M47K Source: http://www.osram.convergy.de/
SJ1 SJ2 = jumper:SJ2W: SMD solder JUMPER
SJ3 = jumper:SJ: SMD solder JUMPER
TC-JTAG2 = TagConnect:TC2050-IDC: Tag-Connect In Circuit Programming & Debug Cable 10 Pin http://www.tag-connect.com
U0 = Jetfoiler:ATSAMD21J
U1 = Jetfoiler:MS5837-02BA
U2 = Jetfoiler:LTC2875: Datasheet <https://www.analog.com/media/en/technical-documentation/data-sheets/2875f.pdf>
U3 = Jetfoiler:MCP2515
U4 U6 = PSFBC:TPS7A6933QDRQ1; MANUFACTURER: Texas Instruments; PARTNUMBER: TPS7A6933QDRQ1; REFDES: RefDes; TYPE: TYPE
U5 = PSFBC:TXB0104QRGYRQ1; DATASHEET_URL: http://www.ti.com/lit/gpn/TXB0104-Q1; DESCRIPTION: Automotive catalog 4-Bit Bidirectional Voltage-Level Translator with Auto Direction Sensing and +/-1; FAMILY_NAME: AUTO DIRECTION SENSING DUAL SUPPLY TRANSLATOR; GENERIC_PART_NUMBER: TXB0104-Q1; INDUSTRY_STD_PKG_TYPE: VQFN; MANUFACTURER: Texas Instruments; MANUFACTURER_PART_NUMBER: TXB0104QRGYRQ1; PACKAGE_DESIGNATOR: RGY; PIN_COUNT: 14; VENDOR: Texas Instruments
U7 = Custom_library:ICM-20648: ICM-20648 Datasheet <http://www.invensense.com/wp-content/uploads/2017/07/DS-000179-ICM-20648-v1.2-TYP.pdf>
U8 = PSFBC:TLE5012B
U$2 = PSFBC:μCLAMP2492SQ
X1 = Jetfoiler:XTAL: Low cost SMT crystals, no capacitors included http://www.ladyada.net/library/eagle
Y1 = SparkFun:RESONATOR: Resonator Small SMD resonator. This is the itty bitty 10/20MHz resonators with built in caps. CSTCE10M0G55 and CSTCE20M0V53. Footprint has been reviewed closely but hasn't been tested yet.

## Net classes
0 default: width 0.203 mm, drill 0.3 mm, clearance 0.152 mm
1 diff pair: width 0.152 mm, drill 0.2 mm, clearance 0.203 mm

## Board
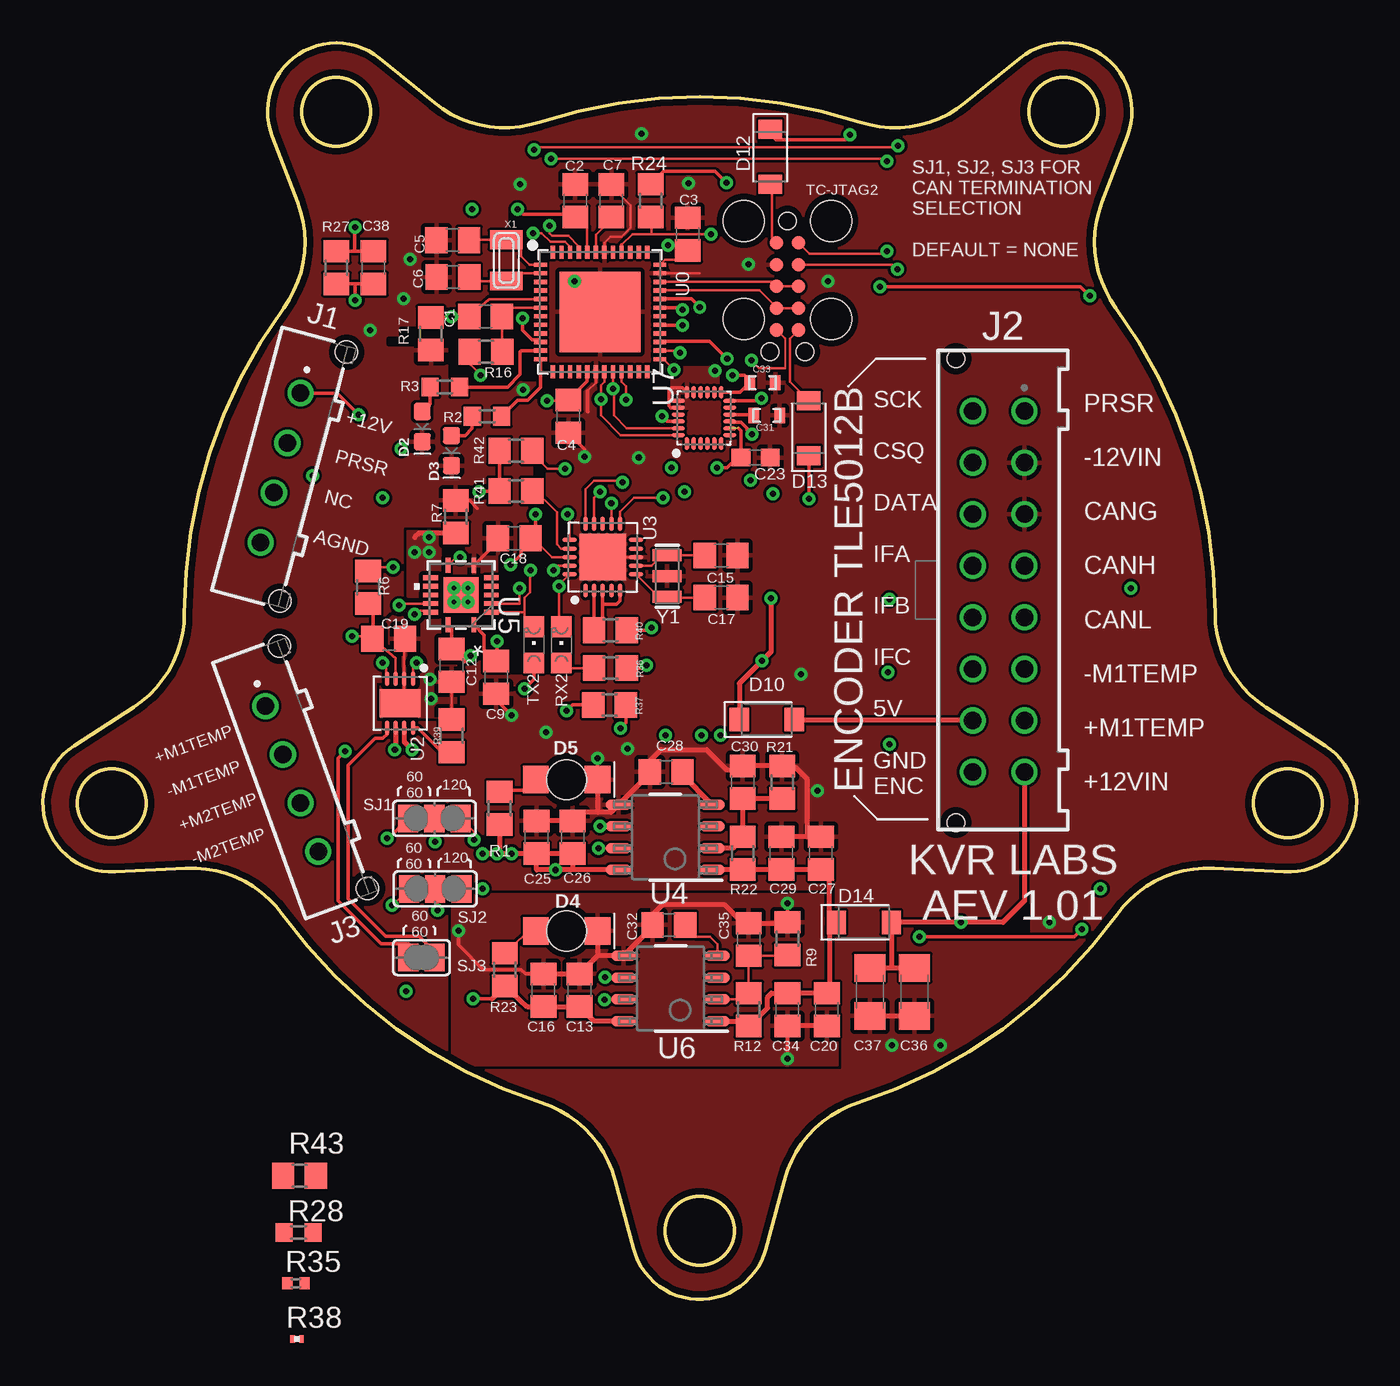
[diagram p8: board, top side]
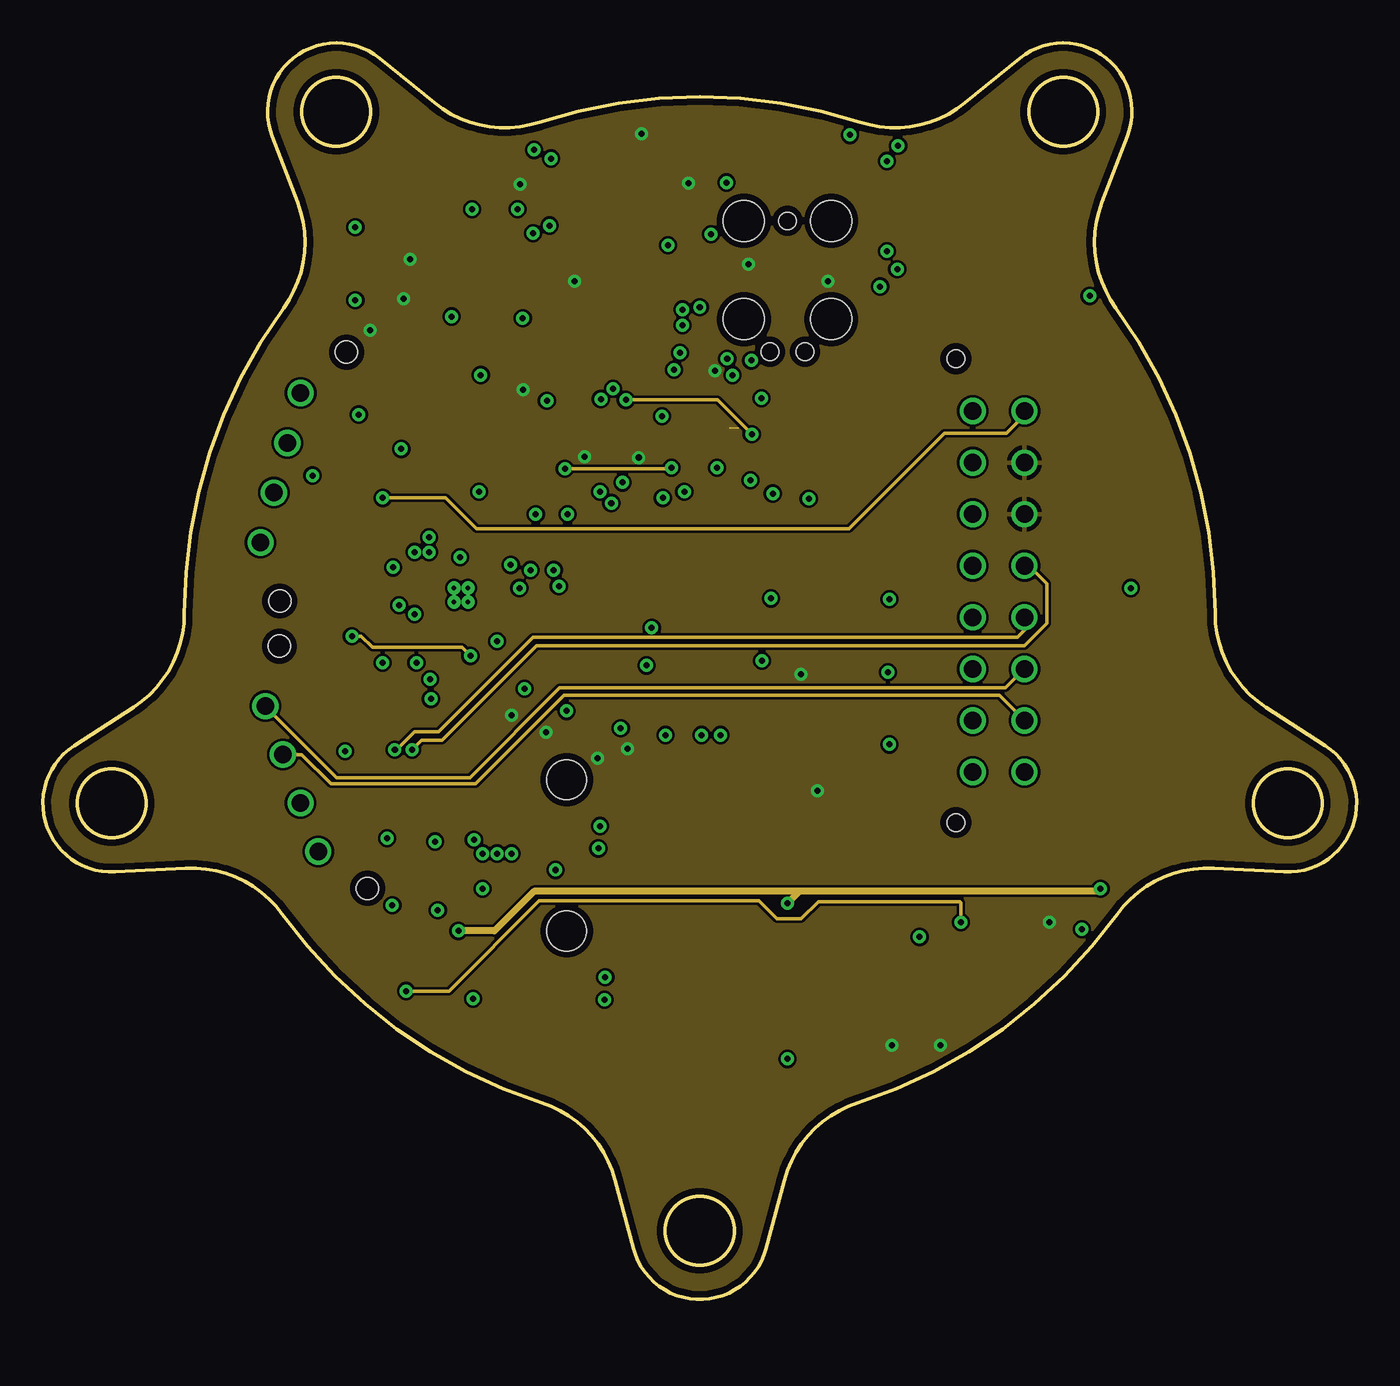
[diagram p9: board, inner layer Route2]
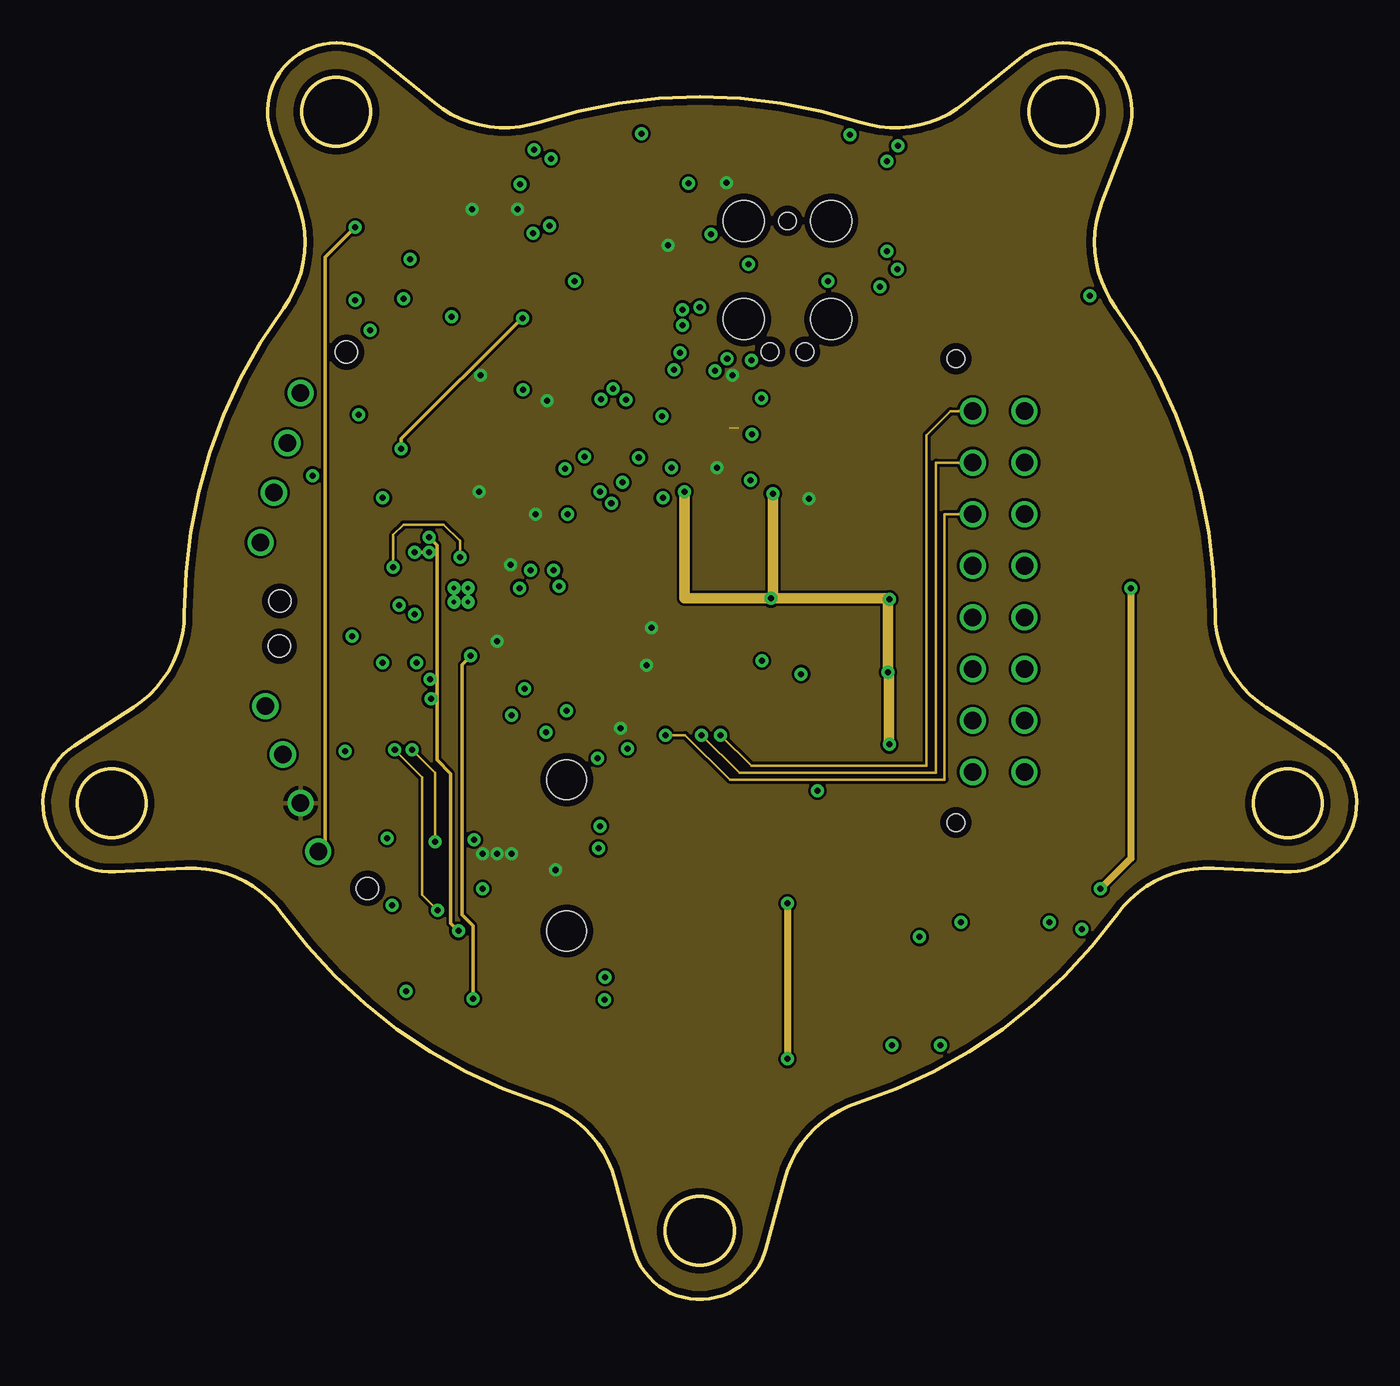
[diagram p10: board, inner layer Route15]
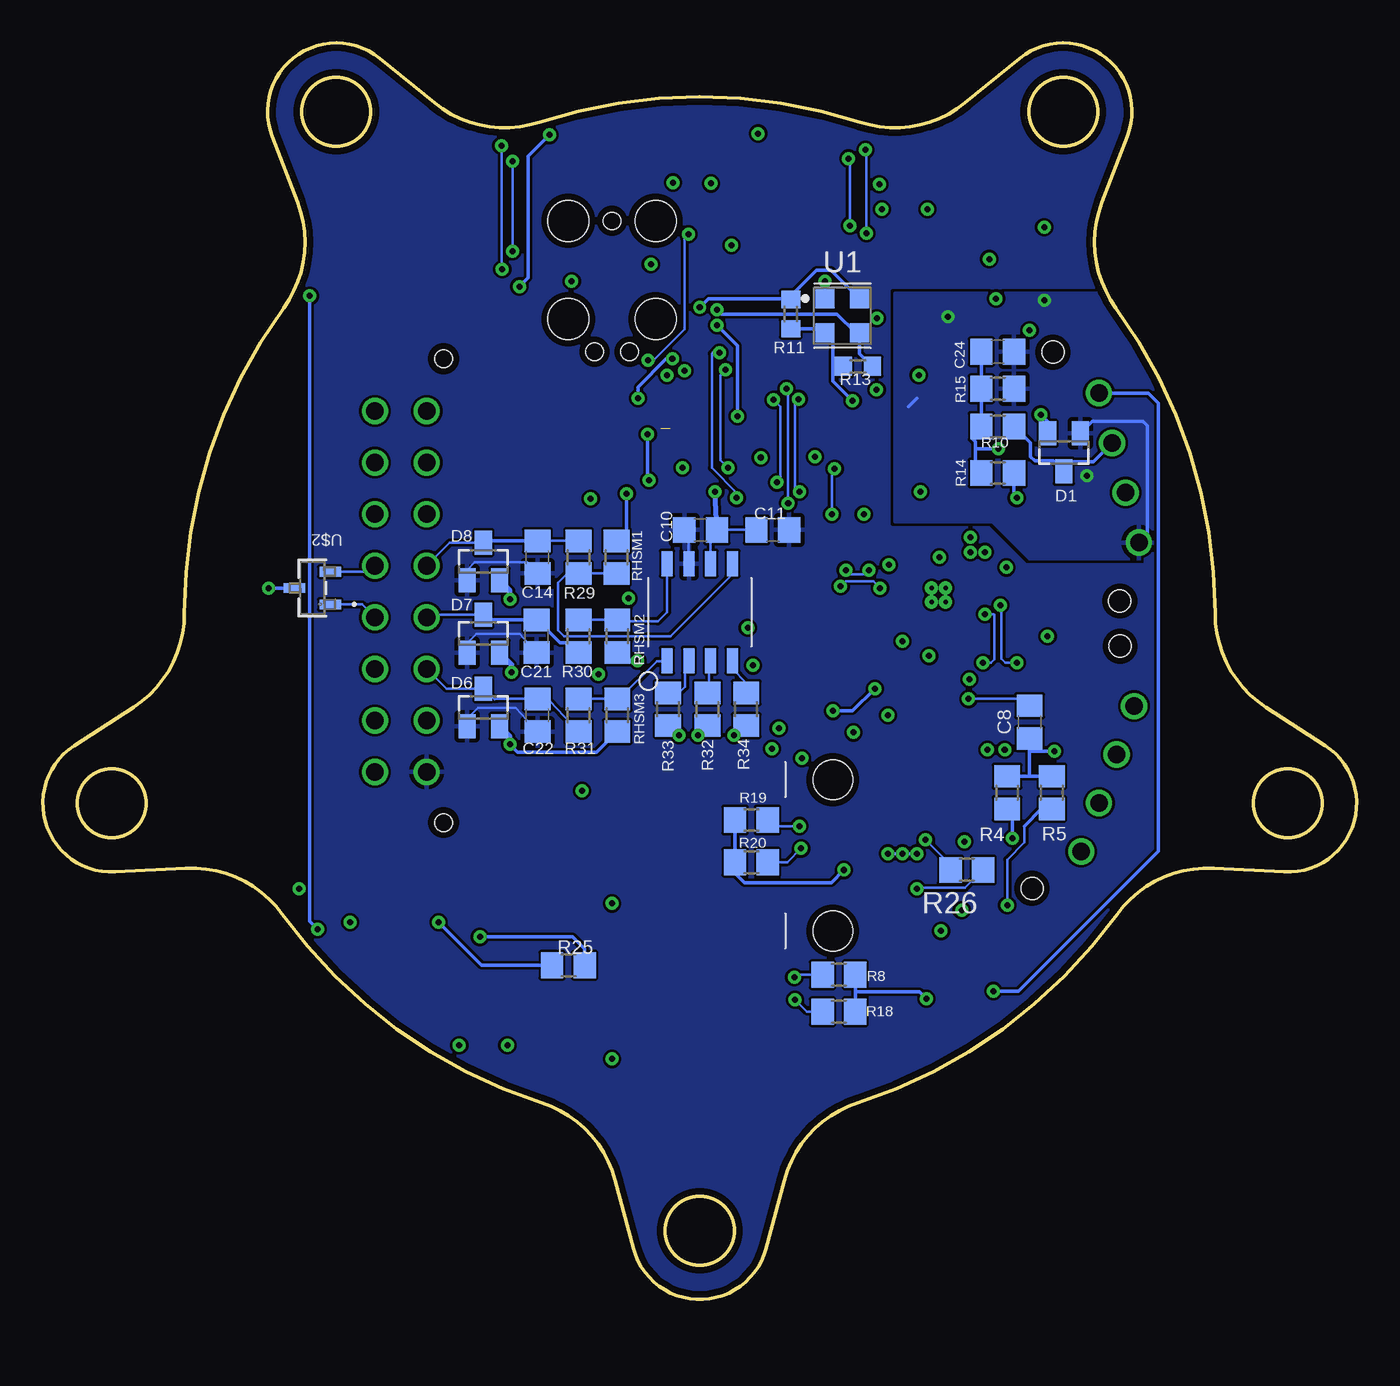
[diagram p11: board, bottom side, seen from below]

Size 76.47 x 73.12 mm. Coordinates in mm from the lower left corner, seen from the top.
Outline: 8.32,25.09 arc-57 13.93,22.41
Outline: 13.93,22.41 arc36 29.02,11.45
Outline: 29.02,11.45 arc-57 33.31,6.94
Outline: 34.37,2.96 arc150 42.1,2.96
Outline: 43.17,6.94 arc-57 47.45,11.45
Outline: 47.45,11.45 arc36 62.54,22.41
Outline: 62.54,22.41 arc-57 68.15,25.09
Outline: 72.27,24.88 arc150 74.65,32.23
Outline: 71.2,34.47 arc-57 68.24,39.93
Outline: 68.24,39.93 arc36 62.47,57.68
Outline: 62.47,57.68 arc-57 61.65,63.84
Outline: 63.13,67.69 arc150 56.88,72.23
Outline: 53.68,69.63 arc-57 47.56,68.51
Outline: 47.56,68.51 arc36 28.91,68.51
Outline: 28.91,68.51 arc-57 22.8,69.63
Outline: 19.59,72.23 arc150 13.34,67.69
Outline: 14.82,63.84 arc-57 14,57.68
Outline: 14,57.68 arc36 8.24,39.93
Outline: 8.24,39.93 arc-57 5.28,34.47
Outline: 1.82,32.23 arc150 4.21,24.88
Outline: 28.91,68.51 arc-57 22.8,69.63
Outline: 22.8,69.63 19.59,72.23
Outline: 19.59,72.23 arc150 13.34,67.69
Outline: 13.34,67.69 14.82,63.84
Outline: 14.82,63.84 arc-57 14,57.68
Outline: 14,57.68 arc36 8.24,39.93
Outline: 8.24,39.93 arc-57 5.28,34.47
Outline: 5.28,34.47 1.82,32.23
Outline: 1.82,32.23 arc150 4.21,24.88
Outline: 4.21,24.88 8.32,25.09
Outline: 8.32,25.09 arc-57 13.93,22.41
Outline: 13.93,22.41 arc36 29.02,11.45
Outline: 29.02,11.45 arc-57 33.31,6.94
Outline: 33.31,6.94 34.37,2.96
Outline: 34.37,2.96 arc150 42.1,2.96
Outline: 42.1,2.96 43.17,6.94
Outline: 43.17,6.94 arc-57 47.45,11.45
Outline: 47.45,11.45 arc36 62.54,22.41
Outline: 62.54,22.41 arc-57 68.15,25.09
Outline: 68.15,25.09 72.27,24.88
Outline: 72.27,24.88 arc150 74.65,32.23
Outline: 74.65,32.23 71.2,34.47
Outline: 71.2,34.47 arc-57 68.24,39.93
Outline: 68.24,39.93 arc36 62.47,57.68
Outline: 62.47,57.68 arc-57 61.65,63.84
Outline: 61.65,63.84 63.13,67.69
Outline: 63.13,67.69 arc150 56.88,72.23
Outline: 56.88,72.23 53.68,69.63
Outline: 53.68,69.63 arc-57 47.56,68.51
Outline: 47.56,68.51 arc36 28.91,68.51
Outline: circle at 38.24,4 radius 2
Outline: circle at 17.08,69.12 radius 2
Outline: circle at 59.4,69.12 radius 2
Outline: circle at 72.47,28.87 radius 2
Outline: circle at 4,28.87 radius 2
Outline: circle at 59.4,69.12 radius 2
Outline: circle at 72.47,28.87 radius 2
Outline: circle at 38.24,4 radius 2
Outline: circle at 4,28.87 radius 2
Outline: circle at 17.08,69.12 radius 2
Copper layers (1*2*15*16): Top 0.035mm / dielectric 1.15mm / Route2 0.035mm / dielectric 0.15mm / Route15 0.035mm / dielectric 0.2mm / Bottom 0.035mm
Design rules "default *": minimum track width 0.14mm, minimum drill 0.35mm, track to track 6mil, track to pad 6mil, pad to pad 6mil, via to via 6mil, smd to smd 0mil, copper to edge 15mil, drill to drill 5mil, minimum pad ring 10mil, minimum via ring 8mil, stop-mask expansion 4mil, vias tented up to drill 0mil, thermal gap 10mil
tRestrict: area 34,50.9 to 36.4,53.5; area 37.2,54.4 to 39.6,55.6; area 39.6,52.9 to 40.8,53.8; area 39.5,52.9 to 40.8,55.5; area 26.6,40.6 to 28.1,43.2; area 27.9,53.5 to 28.7,55.3; area 23.7,53.7 to 24.4,56.8; area 20.8,55.6 to 23.6,56.5; area 20.1,55.6 to 21,55.9; area 28.7,47.6 to 29.1,48.5; area 27.2,62.3 to 28.2,63.2; area 56.8,21.1 to 57.3,23; area 25.6,36.5 to 30.8,39.7

### Footprints (pad centres in the part's own frame; a part is rotated, then mirrored left to right if it is on the bottom)
C0805 = smd 1.3 x 1.5: 1 -0.95,0; 2 0.95,0
C0603 = smd 1.1 x 1: 1 -0.85,0; 2 0.85,0
0603 = smd 0.61 x 0.889: P$1 -0.749,0; P$2 0.749,0
C1206 = smd 1.6 x 1.8: 1 -1.4,0; 2 1.4,0
SOT23 = smd 1 x 1.4: 1 -0.95,-1.1; 2 0.95,-1.1; 3 0,1.1
LED-0603 = smd 1 x 1: A -0.877,0; C 0.877,0
LED-1206-BOTTOM = smd 1.5 x 1.6: A -1.8,0; C 1.8,0 | hole 2.3: 0,0
SODFL3718X115 = smd 1.115 x 1.361: 1 -1.6,0; 2 1.6,0
66200411122 = drill 1.02: 1 4.5,0; 2 1.5,0; 3 -1.5,0; 4 -4.5,0 | hole 1.27: 7.5,-1.96; -7.5,-1.96
66201621122 = drill 1.02: 1 10.4,-1.5; 2 7.4,-1.5; 3 4.4,-1.5; 4 1.4,-1.5; 5 -1.6,-1.5; 6 -4.6,-1.5; 7 -7.6,-1.5; 8 -10.6,-1.5; 9 10.4,1.5; 10 7.4,1.5; 11 4.4,1.5; 12 1.4,1.5; 13 -1.6,1.5; 14 -4.6,1.5; 15 -7.6,1.5; 16 -10.6,1.5 | hole 1.02: -13.55,2.49; 13.45,2.49
R0805 = smd 1.3 x 1.5: 1 -0.95,0; 2 0.95,0
R0603 = smd 1 x 1.1: 1 -0.85,0; 2 0.85,0
R0402 = smd 0.6 x 0.7: 1 -0.5,0; 2 0.5,0
R0201 = smd 0.28 x 0.43: 1 -0.255,0; 2 0.255,0
CHIPLED_0805 = smd 1.2 x 1.2: A 0,-1.05; C 0,1.05
SJ_2 = smd 1.168 x 1.6: 1 -1.524,0; 2 0,0; 3 1.524,0
SJ = smd 1.168 x 1.6: 1 -0.762,0; 2 0.762,0
TC2050-IDC = smd 0.787 x 0.787: 1 -2.54,-0.635; 2 -2.54,0.635; 3 -1.27,-0.635; 4 -1.27,0.635; 5 0,-0.635; 6 0,0.635; 7 1.27,-0.635; 8 1.27,0.635; 9 2.54,-0.635; 10 2.54,0.635 | hole 0.991: -3.81,0; 3.81,1.016; 3.81,-1.016 | hole 2.375: -3.81,2.54; -3.81,-2.54; 1.905,2.54; 1.905,-2.54
MICROBUILDER_TQFN48_7MM = smd 0.25 x 0.75: 1 -2.75,-3.475; 2 -2.25,-3.475; 3 -1.75,-3.475; 4 -1.25,-3.475; 5 -0.75,-3.475; 6 -0.25,-3.475; 7 0.25,-3.475; 8 0.75,-3.475; 9 1.25,-3.475; 10 1.75,-3.475; 11 2.25,-3.475; 12 2.75,-3.475; 25 2.75,3.475; 26 2.25,3.475; 27 1.75,3.475; 28 1.25,3.475; 29 0.75,3.475; 30 0.25,3.475; 31 -0.25,3.475; 32 -0.75,3.475; 33 -1.25,3.475; 34 -1.75,3.475; 35 -2.25,3.475; 36 -2.75,3.475 | smd 0.75 x 0.25: 13 3.475,-2.75; 14 3.475,-2.25; 15 3.475,-1.75; 16 3.475,-1.25; 17 3.475,-0.75; 18 3.475,-0.25; 19 3.475,0.25; 20 3.475,0.75; 21 3.475,1.25; 22 3.475,1.75; 23 3.475,2.25; 24 3.475,2.75; 37 -3.475,2.75; 38 -3.475,2.25; 39 -3.475,1.75; 40 -3.475,1.25; 41 -3.475,0.75; 42 -3.475,0.25; 43 -3.475,-0.25; 44 -3.475,-0.75; 45 -3.475,-1.25; 46 -3.475,-1.75; 47 -3.475,-2.25; 48 -3.475,-2.75 | smd 4.7 x 4.7: THERMAL 0,0
DFN330X330X275-4N = smd 1.112 x 1.112: 1 -1,1; 2 -1,-1; 3 1,-1; 4 1,1
SON50P300X300X80-9T165X238N = smd 0.86 x 0.27: 1 -1.435,0.75; 2 -1.435,0.25; 3 -1.435,-0.25; 4 -1.435,-0.75; 5 1.435,-0.75; 6 1.435,-0.25; 7 1.435,0.25; 8 1.435,0.75 | smd 1.65 x 2.38: 9 0,0
QFN50P400X400X100-21T270N = smd 0.837 x 0.264: 1 -1.937,1; 2 -1.937,0.5; 3 -1.937,0; 4 -1.937,-0.5; 5 -1.937,-1; 11 1.937,-1; 12 1.937,-0.5; 13 1.937,0; 14 1.937,0.5; 15 1.937,1 | smd 0.264 x 0.837: 6 -1,-1.937; 7 -0.5,-1.937; 8 0,-1.937; 9 0.5,-1.937; 10 1,-1.937; 16 1,1.937; 17 0.5,1.937; 18 0,1.937; 19 -0.5,1.937; 20 -1,1.937 | smd 2.7 x 2.7: 21 0,0
D0008A_N = smd 1.45 x 0.6: 1 -2.725,1.905; 2 -2.725,0.635; 3 -2.725,-0.635; 4 -2.725,-1.905; 5 2.725,-1.905; 6 2.725,-0.635; 7 2.725,0.635; 8 2.725,1.905
RGY14_2P05X2P05 = smd 0.28 x 0.85: 1 -0.75,1.731; 7 -0.75,-1.731; 8 0.75,-1.731; 14 0.75,1.731 | smd 0.85 x 0.28: 2 -1.769,1; 3 -1.769,0.5; 4 -1.769,0; 5 -1.769,-0.5; 6 -1.769,-1; 9 1.769,-1; 10 1.769,-0.5; 11 1.769,0; 12 1.769,0.5; 13 1.769,1 | smd 2.05 x 2.05: 15 0,0 | drill 0.254 pad 0.508: V -0.406,-0.406; V_1 -0.406,0.406; V_2 0.406,-0.406; V_3 0.406,0.406
ICM-20648 = smd 0.738 x 0.22: 1 -1.496,1; 2 -1.496,0.6; 3 -1.496,0.2; 4 -1.496,-0.2; 5 -1.496,-0.6; 6 -1.496,-1; 13 1.496,-1; 14 1.496,-0.6; 15 1.496,-0.2; 16 1.496,0.2; 17 1.496,0.6; 18 1.496,1 | smd 0.22 x 0.738: 7 -1,-1.496; 8 -0.6,-1.496; 9 -0.2,-1.496; 10 0.2,-1.496; 11 0.6,-1.496; 12 1,-1.496; 19 1,1.496; 20 0.6,1.496; 21 0.2,1.496; 22 -0.2,1.496; 23 -0.6,1.496; 24 -1,1.496
PG-DSO-8 = smd 0.65 x 1.45: P1 -1.905,-2.825; P2 -0.635,-2.825; P3 0.635,-2.825; P4 1.905,-2.825; P5 1.905,2.825; P6 0.635,2.825; P7 -0.635,2.825; P8 -1.905,2.825
SOT-23_3L_ONS = smd 0.568 x 1.259: 1 -0.953,-1.041; 2 0.953,-1.041; 3 0,1.041
XTAL3215 = smd 1.1 x 1.9: P$1 1.2,0; P$2 -1.2,0
RESONATOR-SMD = smd 0.7 x 1.7: 1 -1.2,0; 2 0,0; 3 1.2,0

### Placement (x,y rotation side)
C1  25.77,57.2 180 top
C2  30.99,63.94 90 top
C3  37.54,62 90 top
C4  30.59,51.39 270 top
C5  23.86,61.65 180 top
C6  23.87,59.5 180 top
C7  33.09,63.94 90 top
C8  19.04,33.6 90 bottom
C9  26.39,36.2 270 top
C10  38.19,44.78 180 bottom
C11  33.99,44.78 0 bottom
C12  23.79,36.9 270 top
C13  31.24,18 90 top
C14  47.69,43.2 270 bottom
C15  39.49,43.3 0 top
C16  29.14,18 90 top
C17  39.49,40.85 0 top
C18  27.44,44.3 180 top
C19  20.14,38.45 0 top
C20  45.64,16.87 270 top
C21  47.74,38.6 270 bottom
C22  47.69,34 270 bottom
C23  41.49,49 0 top
C24  20.89,55.15 0 bottom
C25  28.74,26.9 90 top
C26  30.84,26.9 90 top
C27  45.29,25.97 90 top
C28  36.29,30.7 180 top
C29  42.99,25.97 90 top
C30  40.74,30.1 90 top
C31  42.14,51.45 0 top
C32  36.44,21.8 180 top
C33  41.89,53.35 0 top
C34  43.34,16.87 270 top
C35  41.09,20.95 90 top
C36  50.74,17.9 270 top
C37  48.14,17.9 270 top
C38  19.24,60.05 270 top
D1  17.04,49.3 180 bottom
D2  22.08,50.8 270 top
D3  23.79,49.4 270 top
D4  30.49,21.45 0 top
D5  30.49,30.25 0 top
D6  50.84,34.45 0 bottom
D7  50.84,38.75 0 bottom
D8  50.84,42.95 0 bottom
D10  42.14,33.75 0 top
D12  42.34,66.5 270 top
D13  44.59,50.7 90 top
D14  47.79,21.95 0 top
J1  13.84,48.4 75 top
J2  55.64,41.3 90 top
J3  14.49,30.3 110 top
R1  26.59,28.6 270 top
R2  25.85,51.39 0 top
R3  23.4,53.1 0 top
R4  20.34,29.5 270 bottom
R5  17.74,29.5 90 bottom
R6  18.94,41.45 270 top
R7  24.04,45.55 90 top
R8  30.14,18.9 0 bottom
R9  43.34,21 270 top
R10  20.89,50.8 180 bottom
R11  32.94,57.35 270 bottom
R12  41.09,16.87 270 top
R13  29.04,54.3 180 bottom
R14  20.89,48.1 180 bottom
R15  20.89,53 0 bottom
R16  25.79,55.15 0 top
R17  22.59,56.2 90 top
R18  30.14,16.75 0 bottom
R19  35.24,27.9 180 bottom
R20  35.24,25.45 180 bottom
R21  43.04,30.1 270 top
R22  40.74,25.97 270 top
R23  26.89,19.2 270 top
R24  35.39,63.95 90 top
R25  45.89,19.45 0 bottom
R26  22.69,25 180 bottom
R27  17.09,60.05 270 top
R28  14.89,3.9 0 top
R29  45.29,43.2 90 bottom
R30  45.29,38.6 270 bottom
R31  45.29,34 270 bottom
R32  37.79,34.35 270 bottom
R33  40.09,34.35 270 bottom
R34  35.54,34.35 270 bottom
R35  14.74,0.95 0 top
R36  33.04,36.75 0 top
R37  32.99,34.6 0 top
R38  14.79,-2.3 0 top
R39  23.79,32.8 90 top
R40  33.04,38.95 180 top
R41  27.54,47.05 180 top
R42  27.54,49.4 180 top
R43  14.94,7.2 0 top
RHSM1  43.09,43.2 90 bottom
RHSM2  43.04,38.6 270 bottom
RHSM3  43.04,34 270 bottom
RX2  30.19,38.1 0 top
SJ1  22.79,28 180 top
SJ2  22.84,23.9 0 top
SJ3  22.04,19.9 0 top
TC-JTAG2  43.35,58.96 270 top
TX2  28.59,38.1 0 top
U0  32.44,57.47 270 top
U1  29.94,57.25 0 bottom
U2  20.79,34.7 270 top
U3  32.59,43.2 90 top
U4  36.24,26.9 180 top
U5  24.34,41 180 top
U6  36.54,18.1 180 top
U7  38.49,51.3 90 top
U8  38.24,40 0 bottom
U$2  60.79,41.4 90 bottom
X1  26.98,60.47 90 top
Y1  36.34,42.1 270 top

### Tracks (layer width: path | path; a pad name or v marks a point on that pad's centre or on a via)
12VIN
  Top 0.203: C27.1 45.66,25.02 45.79,24.9
  Top 0.305: R22.2 40.65,24.99 | 40.65,24.99 U4.1 | C29.1 42.96,24.99 | 42.96,24.99 40.65,24.99 | C27.1 45.26,24.99 42.96,24.99 | 45.79,25.05 45.79,24.9 45.79,22.35 D14.1 46.09,21.95 45.79,21.65 45.79,17.97 C20.1 C34.1 42.41,17.82 42.19,17.6 42.19,16.95 41.24,16 R12.2 40.93,16.19 U6.1
+3V3  (via drill 0.35)  (1 unrouted)
  Top 0.152: U3.18 29.64,43.2 28.54,44.3 C18.1 | 26.59,47.03 26.55,47.03 R41.2 | v25.49,53.8 v25.48,53.8 | 25.41,53.87 24.89,54.4 R16.1 | C2.1 31.69,62.4 U0.44 | C4.1 30.56,52.3 v29.34,52.3 | U0.36 36.21,60.52 36.97,60.52 | 37.04,60.52 36.97,60.52 | 36.97,60.52 37.39,60.98 | 37.44,60.93 C3.1
  Top 0.203: U7.13 40.58,52.79 C33.P$1 41.14,53.49 40.84,53.8 v40.14,53.8 | 40.49,50.7 40.64,50.55 C23.1 40.44,49 39.84,48.4 v39.24,48.4 | D13.1 v44.59,46.6 | U0.17 31.69,53.44 C4.1 | v36.39,61.35 36.79,61.35 37.04,61.1 37.04,60.52 | 37.44,60.93 37.39,60.98 | R24.2 36.14,65.65 39.14,65.65 v39.79,65 | C2.1 30.83,63.15 27.94,63.15 v27.64,63.45 | U4.8 v29.84,24.99 | R37.2 33.94,33.55 v33.64,33.25 | C18.1 28.39,44.15 27.84,43.6 27.84,43.35 v27.24,42.75 | U5.1 25.69,38.66 25.69,37.8 26.34,37.15 C9.1 26.44,37.2 v26.44,38.3 | v28.69,45.7 28.69,44.45 28.54,44.3 | v25.39,47 25.43,47.03 26.59,47.03 | R42.2 R41.2 | v35.44,39.1 35.29,38.95 R40.1 | v35.14,36.9 34.99,36.75 R36.2 | 25.41,53.87 v25.48,53.8
  Top 0.305: U4.8 30.74,24.99 | 30.74,24.99 v29.84,24.99 28.74,24.99 28.74,25 C25.1 | 30.74,24.99 30.84,25.09 C26.1 C25.1 | C25.1 v27.29,25.95 v26.44,25.95 | v26.44,25.95 v25.59,25.95 | R1.2 26.59,26.1 v26.44,25.95
  Bottom 0.203: v25.59,25.95 v27.29,25.95 | R19.2 R20.2 36.19,24.8 35.64,24.25 30.58,24.25 v29.84,24.99 | 30.49,54.45 30.49,54.1 | 30.49,54.1 30.49,53.45 v29.34,52.3 | R11.2 31.19,56.5 U1.2 30.49,55.8 30.49,54.55 30.14,54.55 R13.2 30.29,54.3 30.49,54.1
  other vias: 24.99,63.45
  pour Route15 (rank 6): -3.71,79.45 -3.71,21.2 19.94,-2.45 56.54,-2.45 82.64,23.65 82.64,71.6 74.79,79.45
+5V  (via drill 0.35)
  Top 0.152: 19.14,38.3 C19.1 | U2.3 20.54,37.3 C19.1 | C19.1 19.04,38.6 v17.99,38.6
  Top 0.203: U5.14 23.79,39.06 C12.1 24.54,37.1 v24.89,37.45 | 26.14,17.5 v25.04,17.5 | R6.2 19.22,40.21 19.22,38.42 19.21,38.42 C19.1
  Top 0.305: U6.8 32.09,16.19 C13.1 C16.1 28.19,17.05 R23.2 26.14,17.5
  Route2 0.203: v17.99,38.6 18.54,38.6 19.19,37.95 24.39,37.95 v24.89,37.45
  Route15 0.203: v25.04,17.5 25.04,21.75 24.39,22.4 24.39,36.95 v24.89,37.45
  Bottom 0.203: R8.2 29.19,17.9 | 29.19,17.9 R18.2 | 29.19,17.9 25.44,17.9 v25.04,17.5
+5V/1  (via drill 0.35)
  Top 0.305: 42.39,47 v42.49,46.9 | v42.39,40.8 42.39,37.7 v41.86,37.17 40.54,35.85 D10.1 | 49.24,40.8 v49.29,40.75
  Route15 0.61: v49.29,32.3 49.24,32.35 49.24,36.45 v49.19,36.5 49.19,40.65 | 49.19,40.65 v49.29,40.75 | v42.39,40.8 49.04,40.8 49.19,40.65 | v42.49,46.9 42.49,40.9 v42.39,40.8 | v37.34,47 37.34,40.8 v42.39,40.8
  Bottom 0.152: 37.34,44.61 C10.1 37.47,44.65 37.47,44.23 | 37.34,44.61 37.36,44.35 | 37.47,44.23 37.34,44.35 37.36,44.35 | 37.47,44.23 37.6,44.1 U8.P6 | 37.51,44.35 37.36,44.35 | C11.1 37.17,44.78 37.34,44.61
  Bottom 0.203: RHSM1.2 42.49,44.75 v42.49,46.9 | RHSM3.2 44.24,31.85 48.84,31.85 v49.29,32.3
  Bottom 0.305: C10.1 v37.34,47 | v49.29,32.3 49.29,32.75 D6.2 | v49.19,36.5 49.19,36.95 D7.2 | v49.29,40.75 49.29,41.25 D8.2 | RHSM2.2 42.56,37.17 v41.86,37.17
+12V  (via drill 0.35)
  Top 0.203: v18.39,51.5 17.14,52.74 J1.1
  Top 0.305: C37.1 49.44,19.3 | 49.44,19.3 C36.1 | 49.44,19.3 49.39,19.35 D14.2 v53.44,21.95 55.89,21.95 57.14,23.2 J2.8
  Route2 0.203: v21.14,17.95 23.64,17.95 28.89,23.2 41.69,23.2 42.74,22.15 44.14,22.15 45.14,23.15 53.39,23.15 53.44,23.1 v53.44,21.95
  Bottom 0.203: R25.1 50.94,19.45 v53.44,21.95 | J1.1 12.13,52.74 11.54,52.15 11.54,26.1 19.69,17.95 v21.14,17.95 | D1.2 17.99,51.1 v18.39,51.5
+M1TEMP
  Route2 0.203: J2.6 56.04,35.6 30.09,35.6 24.85,30.36 17.11,30.36 J3.1
+VBUS  (via drill 0.35)
  Top 0.203: v46.98,67.77 46.71,67.5 42.69,67.5 42.34,67.85 D12.1 | v48.74,58.95 60.39,58.95 v60.94,58.4 | v60.49,21.55 60.04,21.1 v51.04,21.1
  Bottom 0.203: v46.98,67.77 48.24,66.51 48.24,59.45 v48.74,58.95 | v60.94,58.4 60.94,22 v60.49,21.55 | v51.04,21.1 45.64,21.1 44.94,20.4 R25.2
-M1TEMP
  Route2 0.203: J2.7 55.69,35.15 30.34,35.15 25.19,30 16.78,30 15.07,31.71 J3.2
-M2TEMP  (via drill 0.35)
  Top 0.203: R27.1 18.14,61 | 18.14,61 C38.1 | 18.14,61 18.14,62.35 v18.19,62.4
  Route15 0.203: J3.4 16.44,26.48 16.44,60.65 v18.19,62.4
_+5V_ENC
  Top 0.305: J2.15 43.79,33.7 D10.2
_+VBUS
  Top 0.152: TC-JTAG2.1 42.44,61.77 42.44,64.8 D12.2
AGND  (via drill 0.35)
  Top 0.152: U0.5 25.97,58.22 C1.2 24.78,57.16 24.67,57.05
  Top 0.203: 24.78,57.16 24.77,57.15 R17.2 23.74,57.15 v23.79,57.2 | R27.2 18.19,59.1 | 18.19,59.1 C38.2 | 18.19,59.1 v18.19,58.15
  Bottom 0.203: J1.4 12.19,44.53 12.19,50.85 12.44,51.1 15.39,51.1 D1.1 16.09,50.45 | 25.59,52.45 26.09,51.95
  other vias: 15.69,47.95
  pour Bottom: 11.74,43.1 19.04,43.1 21.19,45.25 26.89,45.25 26.89,58.55 11.74,58.55
CAN_RX_3V3  (via drill 0.35)
  Top 0.152: U5.3 27.74,40.5 v27.74,41.4 | U3.20 30.04,41.58 v30.04,41.5 30.04,39.3 RX2.C
  Bottom 0.152: v27.74,41.4 28.14,41.8 29.74,41.8 v30.04,41.5
CAN_RX_5V  (via drill 0.35)
  Top 0.152: U2.4 19.98,36.19 19.98,36.85 v19.78,37.05 | U5.12 20.84,40.5 v20.74,40.4
  Bottom 0.152: v19.78,37.05 20.43,37.05 20.68,37.3 20.68,40.34 v20.74,40.4
CAN_TX_3V3  (via drill 0.35)
  Top 0.152: U3.19 29.99,42.7 v29.74,42.45 | U5.2 27.99,40 28.04,40.04 | 28.04,40.04 28.04,40.1 28.04,40.84 28.34,41.14 28.34,42.4 v28.39,42.45 | 28.04,40.04 28.04,39.69 TX2.C
  Bottom 0.152: v28.39,42.45 28.64,42.2 29.49,42.2 v29.74,42.45
CAN_TX_5V  (via drill 0.35)
  Top 0.152: v21.64,39.89 21.84,40.09 22.48,40.09 U5.13 | U2.1 21.54,36.84 v21.74,37.05
  Bottom 0.152: v21.74,37.05 21.29,37.05 21.09,37.25 21.09,39.85 21.13,39.89 v21.64,39.89
CANH  (via drill 0.35)
  Top 0.152: SJ1.2 22.79,26.7 v22.84,26.65
  Top 0.305: U2.7 21.04,32.45 v21.49,32
  Route2 0.203: v21.49,32 22.04,32.55 23.24,32.55 28.73,38.04 57.13,38.04 58.44,39.35 58.44,41.65 57.39,42.7 J2.4
  Route15 0.152: v21.49,32 22.84,30.65 v22.84,26.65
  Bottom 0.152: U$2.2 57.48,42.35 J2.4
CANL  (via drill 0.35)
  Top 0.152: SJ2.2 22.99,23.75 v22.99,22.65
  Top 0.305: U2.6 20.54,32.05 v20.49,32
  Route2 0.203: J2.5 57.14,38.95 56.74,38.55 28.54,38.55 23.04,33.05 21.64,33.05 20.59,32 v20.49,32
  Route15 0.152: v20.49,32 22.09,30.4 22.09,23.55 v22.99,22.65
  Bottom 0.152: U$2.1 58.4,40.44 58.4,40.45 57.89,40.45 J2.5
CSQ  (via drill 0.35)
  Route15 0.152: v38.34,32.85 40.54,30.65 51.99,30.65 51.99,48.7 J2.10
  Bottom 0.152: R32.2 38.34,32.92 v38.34,32.85
DATA  (via drill 0.35)
  Route15 0.152: v36.24,32.85 37.39,32.85 39.99,30.25 52.49,30.25 52.49,45.7 J2.11
  Bottom 0.152: v36.24,32.85 36.18,32.85 R34.2
GND  (via drill 0.35)
  Top 0.152: U3.8 U3.21 | C7.2 33.09,64.81 34.22,63.68 34.22,62.37 33.69,61.85 33.04,61.85 32.69,61.5 U0.42 | U0.18 32.19,53.35 31.72,52.87 | U0.35 38.23,59.72
  Top 0.203: U5.7 26.49,44.13 C18.2 | C9.2 26.39,34.9 v27.29,34 | D5.C v32.29,31.5 | C4.2 31.54,49.49 v31.54,49.05 | 31.72,52.87 31.72,51.67 31.74,51.65 | R7.2 24.84,46.5 25.29,46.05 | U7.20 36.54,51.9 36.44,52 36.44,52.3 | 36.44,52.3 U7.19 | U7.18 37.23,53.05 36.59,53.05 36.44,52.9 36.44,52.3
  Top 0.305: C25.2 C26.2 30.84,28.35 32.29,28.35 | 32.29,28.35 33.06,28.35 U4.5 35.34,30.63 C28.2 35.34,31.35 35.99,32 38.64,32 39.84,30.8 40.49,30.8 C30.2 | C27.2 44.49,26.92 | 44.49,26.92 C29.2 | C30.2 41.03,31.34 | C37.2 50.04,16.5 50.39,16.15 C36.2 | 44.49,26.92 44.49,30.3 43.81,30.97 R21.1 C30.2 | D5.C 32.29,28.35
  Bottom 0.203: U1.1 v30.94,59.25
  other vias: 34.69,49 39.14,54.05 27.94,52.95 21.39,60.55 37.59,64.95 27.79,64.9 34.04,32.05 45.09,29.6 49.44,14.8 52.24,14.8 20.99,58.25 29.29,33 44.14,36.4 41.09,60.25 45.69,59.25 34.84,67.85 19.04,56.4 58.59,21.95
  pour Top (isolate 0.127, rank 6): -2.91,55.95 -2.91,28.7 26.09,-0.3 49.89,-0.3 77.04,26.85 77.04,73.65 14.79,73.65
  pour Route2 (isolate 0.127, rank 6): -13.36,68.65 -13.36,21.5 16.59,-8.45 18.19,-10.05 61.79,-10.05 66.59,-10.05 95.74,19.1 95.74,63.15 76.44,82.45 0.44,82.45
GND1
  Bottom 0.152: U8.P7 38.89,44.63 C10.2 | C14.2 48.28,42.9 51.34,42.9 51.79,42.45 D8.1 | C21.2 48.73,38.75 51.24,38.75 51.79,38.2 D7.1 | C22.2 48.96,34.45 51.14,34.45 51.79,33.8 D6.1
  pour Bottom (isolate 0.127, rank 6): -9.66,43.1 -9.66,18.3 9.49,-0.85 12.14,-3.5 56.49,-3.5 82.14,22.15 82.14,28.2 82.14,59.2 64.54,76.8 53.39,87.95 17.54,87.95 -9.66,60.75
GND_CAN  (via drill 0.35)
  Top 0.152: 20.79,35.07 U2.9 21.04,34.95 U2.2 21.04,38.4 C19.2 | R39.2 C12.2
  Top 0.203: R9.1 v43.34,23.05 | C34.2 v43.34,14 | C16.2 28.1,18.95 27.84,19.2 26.23,19.2 25.64,19.2 24.19,20.65 v24.19,21.45
  Top 0.305: v22.49,44.35 22.74,44.6 R7.1 21.89,44.6 21.64,44.35 | 21.39,38.05 C19.2 | U2.9 20.79,34.96 | C20.2 C34.2 | R9.1 43.3,21.9 C35.2 40.74,21.9 39.64,23 36.09,23 35.49,22.4 C32.2 35.49,21.68 U6.5 32.29,20 | C16.2 C13.2 32.29,20 | D4.C 32.29,20
  Route2 0.406: v43.34,23.05 44.04,23.75 | v61.57,23.9 61.42,23.75 44.04,23.75 | 44.04,23.75 28.59,23.75 26.29,21.45 v24.19,21.45
  Route15 0.203: v22.49,44.35 22.94,43.9 22.94,43.45 | v22.59,34.95 22.94,35.3 | 22.94,43.45 22.94,36.05 | 22.94,36.05 22.94,35.3 | v22.54,36.1 22.89,36.1 22.94,36.05 | v21.64,43.5 22.89,43.5 22.94,43.45 | v24.19,21.45 23.74,21.9 23.74,30.6 22.94,31.4 22.94,35.3
  Route15 0.406: v63.34,41.4 63.34,25.66 v61.57,23.9 | v43.34,23.05 v43.34,14
  Bottom 0.152: C8.2 19.09,34.55 19.49,34.95 v22.59,34.95
  Bottom 0.203: U$2.3 v63.34,41.4
  other vias: 22.49,43.5
  pour Top (isolate 0.254): 23.19,44.75 21.24,44.75 21.19,44.7 21.19,40.6 19.64,39.05 19.64,33.85 24.04,33.85 24.09,33.9 24.09,37.75 23.19,38.65
  pour Top: 23.79,23.6 23.79,13.6 46.29,13.6 46.29,23.6
IFA
  Bottom 0.152: D8.3 52.79,44.05 J2.12 | C14.1 R29.2
  Bottom 0.203: C14.1 50.74,44.15 D8.3
IFB
  Bottom 0.152: D7.3 53.99,39.85 J2.13
  Bottom 0.203: D7.3 50.54,39.55 C21.1 47.7,39.55 46.37,38.22 45.86,38.22 R30.2
IFC
  Bottom 0.152: J2.14 52.99,35.55 D6.3 50.79,35.55 50.18,34.94 50.04,34.95 C22.1 | 47.64,34.9 C22.1 | R31.2 46.96,34.81 C22.1
N$2
  Top 0.203: D5.A 28.09,29.65 26.69,29.65
  Top 0.305: D5.A 28.14,29.7 | 26.69,29.65 R1.1
N$3
  Top 0.203: D2.A 22.55,52.14 R3.1
N$4
  Top 0.203: D3.A 24.56,50.27 25,50.71 R2.1
N$5
  Top 0.152: U6.2 40.82,17.46 R12.1 C35.1 43.28,20 R9.2
N$6  (via drill 0.35)
  Top 0.152: U5.8 24.06,43.2 v24.29,43.2 | R6.1 19.38,42.4 19.46,42.65 19.51,42.6 v20.39,42.6
  Route15 0.152: v24.29,43.2 24.29,44.15 23.34,45.1 20.99,45.1 20.39,44.5 v20.39,42.6
N$7
  Top 0.203: R39.1 23.24,31.85 21.82,33.26 U2.8
N$8
  Top 0.203: SJ3.2 22.8,20.23 21.89,21.15 19.94,21.15 17.78,23.31 17.78,31.08 19.34,32.65 19.79,32.65 20.04,32.9 U2.5
N$9
  Top 0.152: C5.1 24.76,61.67 X1.P$1 27.28,61.67 27.83,61.12 27.83,60.71 28.32,60.22 U0.1
N$10
  Top 0.152: C6.1 24.99,59.27 X1.P$2 27.41,59.27 27.86,59.72 U0.2
N$12
  Top 0.305: U4.2 40.17,26.26 R22.1 C30.1 | C30.1 40.34,28.75 | C30.1 41.25,29.65 | R21.2 C30.1
N$13
  Top 0.152: 43.98,56.24 TC-JTAG2.10 43.48,55.92 43.48,53.4 D13.2
N$16  (via drill 0.35)
  Top 0.152: U4.6 33.5,27.55 v32.44,27.55
  Bottom 0.152: v32.44,27.55 33.94,27.55 R19.1
N$17  (via drill 0.35)
  Top 0.152: U4.7 32.35,26.26 v32.34,26.25
  Bottom 0.152: R20.1 33.14,25.45 v32.34,26.25
N$18
  Top 0.305: U4.4 37.24,30.53 C28.1
N$19  (via drill 0.35)
  Top 0.152: U6.6 32.75,18.73 v32.74,18.75
  Bottom 0.152: R8.1 32.59,18.9 v32.74,18.75
N$20  (via drill 0.35)
  Top 0.152: U6.7 32.7,17.46 v32.69,17.45
  Bottom 0.152: R18.1 31.99,16.75 v32.69,17.45
N$21
  Top 0.152: C32.1 37.99,21.2 37.99,21.15 38.04,21.1 38.84,21.1 39.26,20.67 U6.4
N$22
  Top 0.152: R23.1 28.29,21.45 D4.A
N$23
  Top 0.152: U0.6 27.04,57.72 C1.1 26.74,57.18 R16.2
N$26
  Top 0.152: 30.19,36.5 RX2.A 30.49,36.75 R36.1
N$27  (via drill 0.35)
  Top 0.203: R37.1 30.84,34.6 v30.49,34.25 | TX2.A 28.59,36.1 v28.04,35.55
  Bottom 0.203: v28.04,35.55 29.34,34.25 v30.49,34.25
N$30
  Top 0.152: 30.29,43.7 U3.17 30.15,43.7 29.92,43.93 29.92,45.82 28.49,47.25 R41.1
N$31
  Top 0.203: U3.2 R40.2 32.59,39.45 32.59,40.4 | U3.3 32.59,40.4 | 32.59,40.4 32.64,40.45 33.39,40.45 33.59,40.65 U3.5
N$32
  Top 0.152: U3.6 35.82,40.9 Y1.3 36.39,40.85 C17.1
N$33
  Top 0.152: U3.7 35.44,42.7 36.04,43.3 Y1.1 C15.1
N$35
  Bottom 0.152: U8.P3 37.7,37.07 37.7,35.05 37.74,35.25 R32.1
N$36
  Bottom 0.152: U8.P2 38.87,36.8 39.09,36.58 39.09,35.65 39.58,35.15 R33.1
N$37
  Bottom 0.152: U8.P4 36.33,36.69 35.54,35.9 R34.1
N$38
  Bottom 0.152: 36.33,43.17 U8.P5 36.33,42.2 39.94,38.6 46.14,38.6 46.49,38.95 46.49,41.7 45.87,42.31 R29.1 RHSM1.1
N$39
  Bottom 0.152: 40.14,43.3 U8.P8 40.14,39.99 40.68,39.46 42.95,39.46 | RHSM2.1 R30.1
  Bottom 0.203: 42.95,39.46 RHSM2.1
N$40
  Bottom 0.152: 40.14,37.15 U8.P1 40.14,37.47 40.37,37.7 | 40.14,37.15 40.14,36.82 | RHSM3.1 R31.1 | 40.14,37.15 40.74,37.15 42.94,34.95
  Bottom 0.203: RHSM3.1 42.94,34.95
PA05/A4-PSR  (via drill 0.35)
  Top 0.203: U0.10 28.84,55.84 28.48,55.84 27.93,56.39 v27.93,57.1
  Route15 0.203: v27.93,57.1 27.88,57.1 20.86,50.09 v20.86,49.5
  Bottom 0.203: 22.19,49.45 22.19,49.92 22.36,50.1 22.19,50.1 21.84,50.45 R10.2 R15.1 C24.1 | 22.19,49.45 22.19,48.45 R14.2 | v20.86,49.5 22.14,49.5 22.19,49.45
PA06/D8-LED1
  Top 0.203: U0.11 28.94,55.2 27.84,55.2 27.79,55.15 27.79,53.85 27.04,53.1 R3.2
PA07/D9-LED2
  Top 0.203: R2.2 27.62,52.31 28.2,52.31 28.96,53.08 U0.12
PA12/MISO  (via drill 0.35)
  Top 0.152: U0.21 33.69,53.4 33.94,53.15 v33.94,52.35 | v33.74,47.55 33.64,47.65 32.09,47.65 31.59,47.15 U3.15
  Top 0.203: U7.9 40.02,51.06 40.63,51.06 40.99,50.69 40.99,50.62 v41.27,50.35 | 33.87,47.68 v33.74,47.55
  Route2 0.203: v33.94,52.35 39.27,52.35 v41.27,50.35
  Bottom 0.152: v33.74,47.55 33.54,47.75 33.54,51.95 v33.94,52.35
  Bottom 0.203: v41.27,50.35 41.27,47.76 v41.19,47.68
PA16/D11-CAN_CS  (via drill 0.35)
  Top 0.152: U3.16 30.65,45.58 v30.54,45.7 | 36.54,48.35 v36.59,48.4 | U0.25 36.12,54.72 v36.74,54.1 | 29.39,48.35 28.49,49.25 R42.1 | 29.39,48.35 | v30.39,48.35 29.39,48.35
  Route2 0.203: v30.39,48.35 36.54,48.35 v36.59,48.4
  Bottom 0.152: v30.39,48.35 30.54,48.2 v30.54,45.7 | v36.59,48.4 37.04,48.85 37.04,53.8 v36.74,54.1
PA17/D13-CAN_IRQ  (via drill 0.35)
  Top 0.152: U3.11 33.59,45.83 34.4,46.65 v36.09,46.65 | v37.09,55.1 36.99,55.2 35.93,55.2 U0.26
  Bottom 0.152: v36.09,46.65 36.09,46.95 37.54,48.4 37.54,55.05 37.44,55.15 37.14,55.15 v37.09,55.1
PA18/D10-IMU_INT  (via drill 0.35)
  Top 0.203: U7.12 41.69,52.3 v41.84,52.45 | U0.27 35.96,55.77 38.82,55.77 v39.84,54.75
  Bottom 0.203: v39.84,54.75 40.19,54.75 41.84,53.1 v41.84,52.45
PA20/D6-IMU_CS  (via drill 0.35)
  Top 0.203: U7.22 36.34,51.1 v36.04,51.4 | v37.24,56.7 35.93,56.7 U0.29
  Bottom 0.203: v36.04,51.4 36.04,55.5 v37.24,56.7
PA22/SCL  (via drill 0.35)
  Top 0.203: v37.24,57.6 37.03,57.6 36.92,57.72 U0.31
  Bottom 0.203: v37.24,57.6 36.98,57.35 30.24,57.35 29.14,56.25 U1.3 28.94,55.05 R13.1
PA23/SDA  (via drill 0.35)
  Top 0.203: U0.32 35.93,58.24 37.75,58.24 v38.24,57.75
  Bottom 0.203: v38.24,57.75 37.74,58.25 33.09,58.25 | U1.4 30.59,59.9 31.44,59.9 33.09,58.25 | R11.1 32.99,58.25 33.09,58.25
PA24/USBD_N
  Top 0.152: 42.64,57.69 42.64,57.8 42.59,57.85 41.71,58.72 40.11,58.72 U0.33 | TC-JTAG2.8 42.94,57.69
  Top 0.203: 42.94,57.69 TC-JTAG2.7 42.59,57.81 42.59,57.85
PA25/USBD_P
  Top 0.152: 35.96,59.27 U0.34 42.45,59.22 TC-JTAG2.5 TC-JTAG2.6
PA30/SWCLK  (via drill 0.35)
  Top 0.152: v49.14,61 48.99,60.85 44.63,60.85 TC-JTAG2.2 | U0.45 31.19,61.29 30.59,61.9 29.64,61.9 29.49,62.05 v29.49,62.5 | v49.14,66.25 48.99,66.4 v29.59,66.4
  Bottom 0.152: v29.49,62.5 29.49,66.3 v29.59,66.4 | v49.14,66.25 v49.14,61
PA31/SWDIO  (via drill 0.35)
  Top 0.152: TC-JTAG2.4 49.46,60.23 v49.74,59.95 | U0.46 30.69,61.26 30.4,61.55 29.54,61.55 29.04,62.05 v28.54,62.05 | v28.59,66.9 28.74,67.05 49.69,67.05 v49.79,67.15
  Bottom 0.152: v28.54,62.05 28.54,66.85 v28.59,66.9 | v49.79,67.15 49.79,60 v49.74,59.95
PB10/MOSI  (via drill 0.35)
  Top 0.152: U0.19 32.69,53.4 32.48,53.19 v32.48,52.4 32.48,51.45 33.64,50.3 U7.24 | v32.44,47 32.09,46.65 U3.14
  Bottom 0.152: v32.44,47 32.69,47.25 32.69,52.19 v32.48,52.4
PB11/SCK  (via drill 0.35)
  Top 0.152: U3.12 v33.09,46.35 | v33.19,53 U0.20 | U7.23 33.99,50.7 33.24,51.45 33.24,52.95
  Top 0.203: v33.19,53 33.24,52.95
  Bottom 0.152: v33.09,46.35 33.09,52.9 v33.19,53
PRESSURE  (via drill 0.35)
  Route2 0.203: v19.79,46.65 23.44,46.65 25.24,44.85 46.94,44.85 52.49,50.4 56.09,50.4 57.14,51.45 J2.1
  Bottom 0.203: R14.1 19.94,46.8 v19.79,46.65
PRSR_OUT
  Bottom 0.203: J1.2 15.32,48.75 17.14,48.75 17.14,48.3 D1.3 17.64,48.8 18.74,48.8 18.99,49.05 18.99,49.85 R10.1
REGOUT2
  Top 0.203: U7.10 41.34,51.5 C31.P$1
RSH  (via drill 0.35)
  Top 0.203: SJ1.3 20.11,26.85 v20.04,26.85
  Bottom 0.203: v20.04,26.85 20.04,28.15 20.34,28.45 R4.2
RSL  (via drill 0.35)
  Top 0.152: SJ2.1 20.36,22.95 v20.34,22.95
  Bottom 0.152: 19.34,27.55 19.34,26.6 20.34,25.6 v20.34,22.95
  Bottom 0.203: R5.1 18.34,28.55 19.34,27.55
RST  (via drill 0.35)
  Top 0.127: 43.19,55.94 43.19,54.2
  Top 0.152: 33.69,61.36 34.32,62 35.44,62 | 35.44,62 v38.89,62 | 42.78,56.34 42.93,56.19 43.19,55.94 | 41.34,54.55 v41.24,54.65 41.69,54.2 43.19,54.2 | R24.1 35.44,62.95 35.44,62
  Top 0.203: 33.69,61.36 U0.40 | 42.78,56.34 TC-JTAG2.9 42.93,56.19
  Bottom 0.152: v38.89,62 39.14,61.75 39.14,56.45 40.91,54.67 40.89,54.65 v41.24,54.65
RTH  (via drill 0.35)
  Top 0.152: SJ1.1 25.09,27.22 v25.09,26.75
  Bottom 0.152: R26.2 23.64,25.3 v25.09,26.75
RTL  (via drill 0.35)
  Top 0.152: SJ2.3 v25.59,23.9
  Bottom 0.152: R26.1 22.79,23.95 25.54,23.95 v25.59,23.9
SCK  (via drill 0.35)
  Route15 0.152: v39.44,32.85 41.24,31.05 51.44,31.05 51.44,50.3 52.84,51.7 J2.9
  Bottom 0.152: R33.2 39.99,33.4 v39.44,32.85
SPLIT  (via drill 0.35)
  Top 0.203: SJ3.1 21.27,20.7 19.69,20.7 17.18,23.21 17.18,31.48 v17.59,31.9
  Bottom 0.152: R5.2 17.74,30.78
  Bottom 0.203: R5.2 19.09,30.45 | 19.09,30.45 R4.1 | C8.1 19.04,31.85 | 19.04,31.85 19.04,30.5 19.09,30.45 | v17.59,31.9 18.99,31.9 19.04,31.85
VDDCORE2
  Top 0.152: U0.43 32.19,61.95 33.13,62.89 C7.1

### Text on the board
tNames: SJ1, SJ2, SJ3 FOR / CAN TERMINATION / SELECTION / / DEFAULT = NONE | +12V / / PRSR / / NC / / AGND | 120 | ENCODER TLE5012B | PRSR / / -12VIN / / CANG / / CANH / / CANL / / -M1TEMP / / +M1TEMP / / +12VIN | 60 / 60 | SCK / / CSQ / / DATA / / IFA / / IFB / / IFC / / 5V / / GND / ENC | 60 / 60 | 120 | KVR LABS / AEV 1.01 | +M1TEMP / / -M1TEMP / / +M2TEMP / / -M2TEMP | 60 / 60